# EAGLE schematic S1400XX_EMS_10HP_DS (EAGLE 6.5.0)

## Sheet 1 of 11: Overview
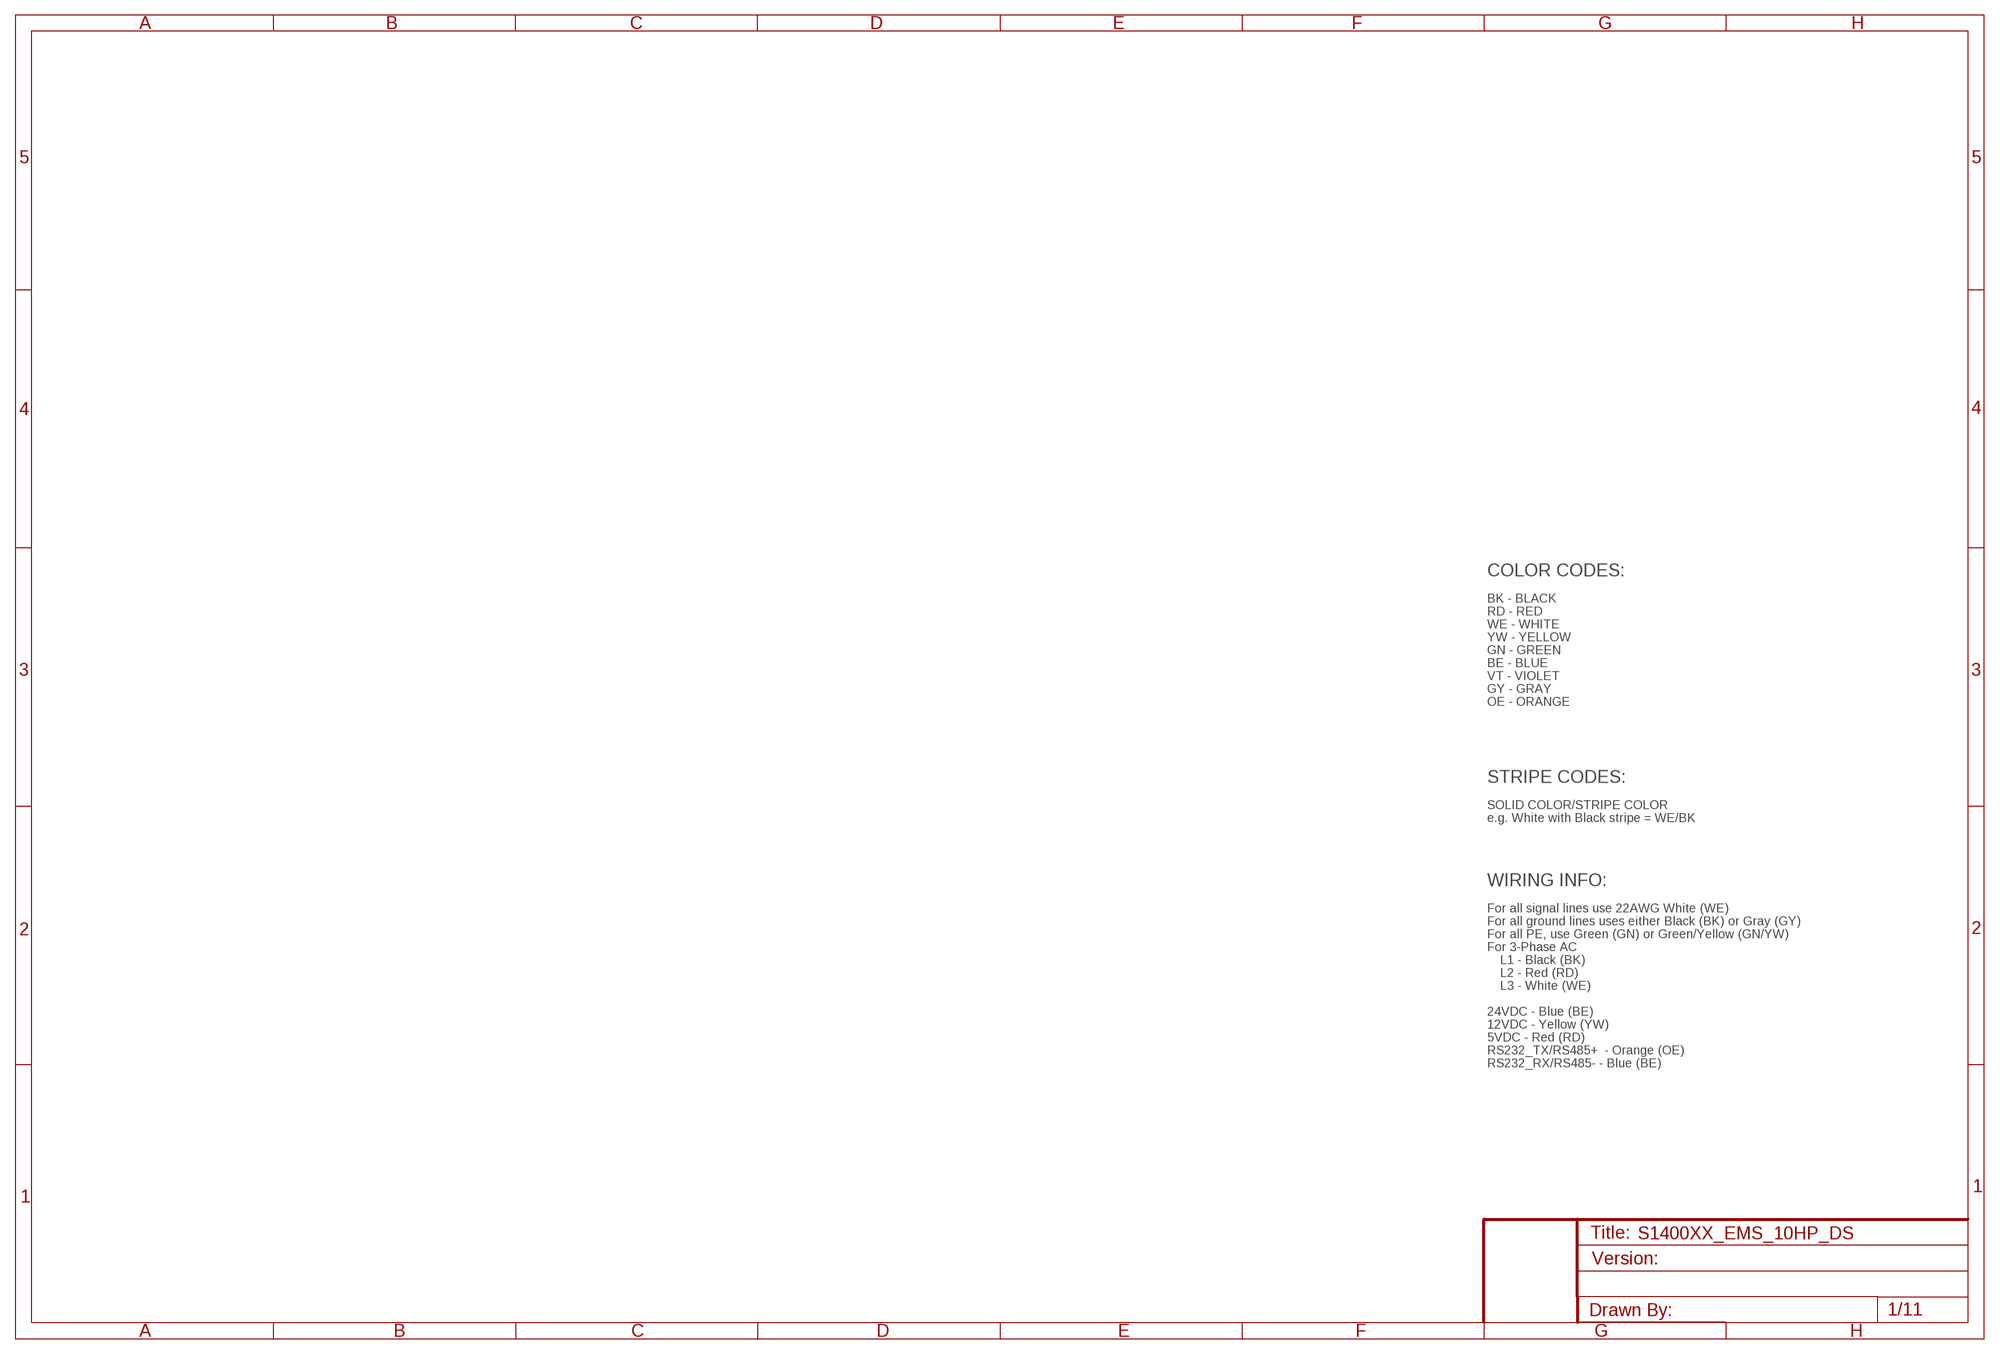
[diagram p0: schematic, sheet 1]

### Notes on the sheet
- COLOR CODES:
- BK - BLACK
- RD - RED
- WE - WHITE
- YW - YELLOW
- GN - GREEN
- BE - BLUE
- VT - VIOLET
- GY - GRAY
- OE - ORANGE
- STRIPE CODES:
- SOLID COLOR/STRIPE COLOR
- e.g. White with Black stripe = WE/BK
- WIRING INFO:
- For all signal lines use 22AWG White (WE)
- For all ground lines uses either Black (BK) or Gray (GY)
- For all PE, use Green (GN) or Green/Yellow (GN/YW)
- For 3-Phase AC
- L1 - Black (BK)
- L2 - Red (RD)
- L3 - White (WE)
- 24VDC - Blue (BE)
- 12VDC - Yellow (YW)
- 5VDC - Red (RD)
- RS232_TX/RS485+  - Orange (OE)
- RS232_RX/RS485- - Blue (BE)

## Sheet 2 of 11: Backplane Layout
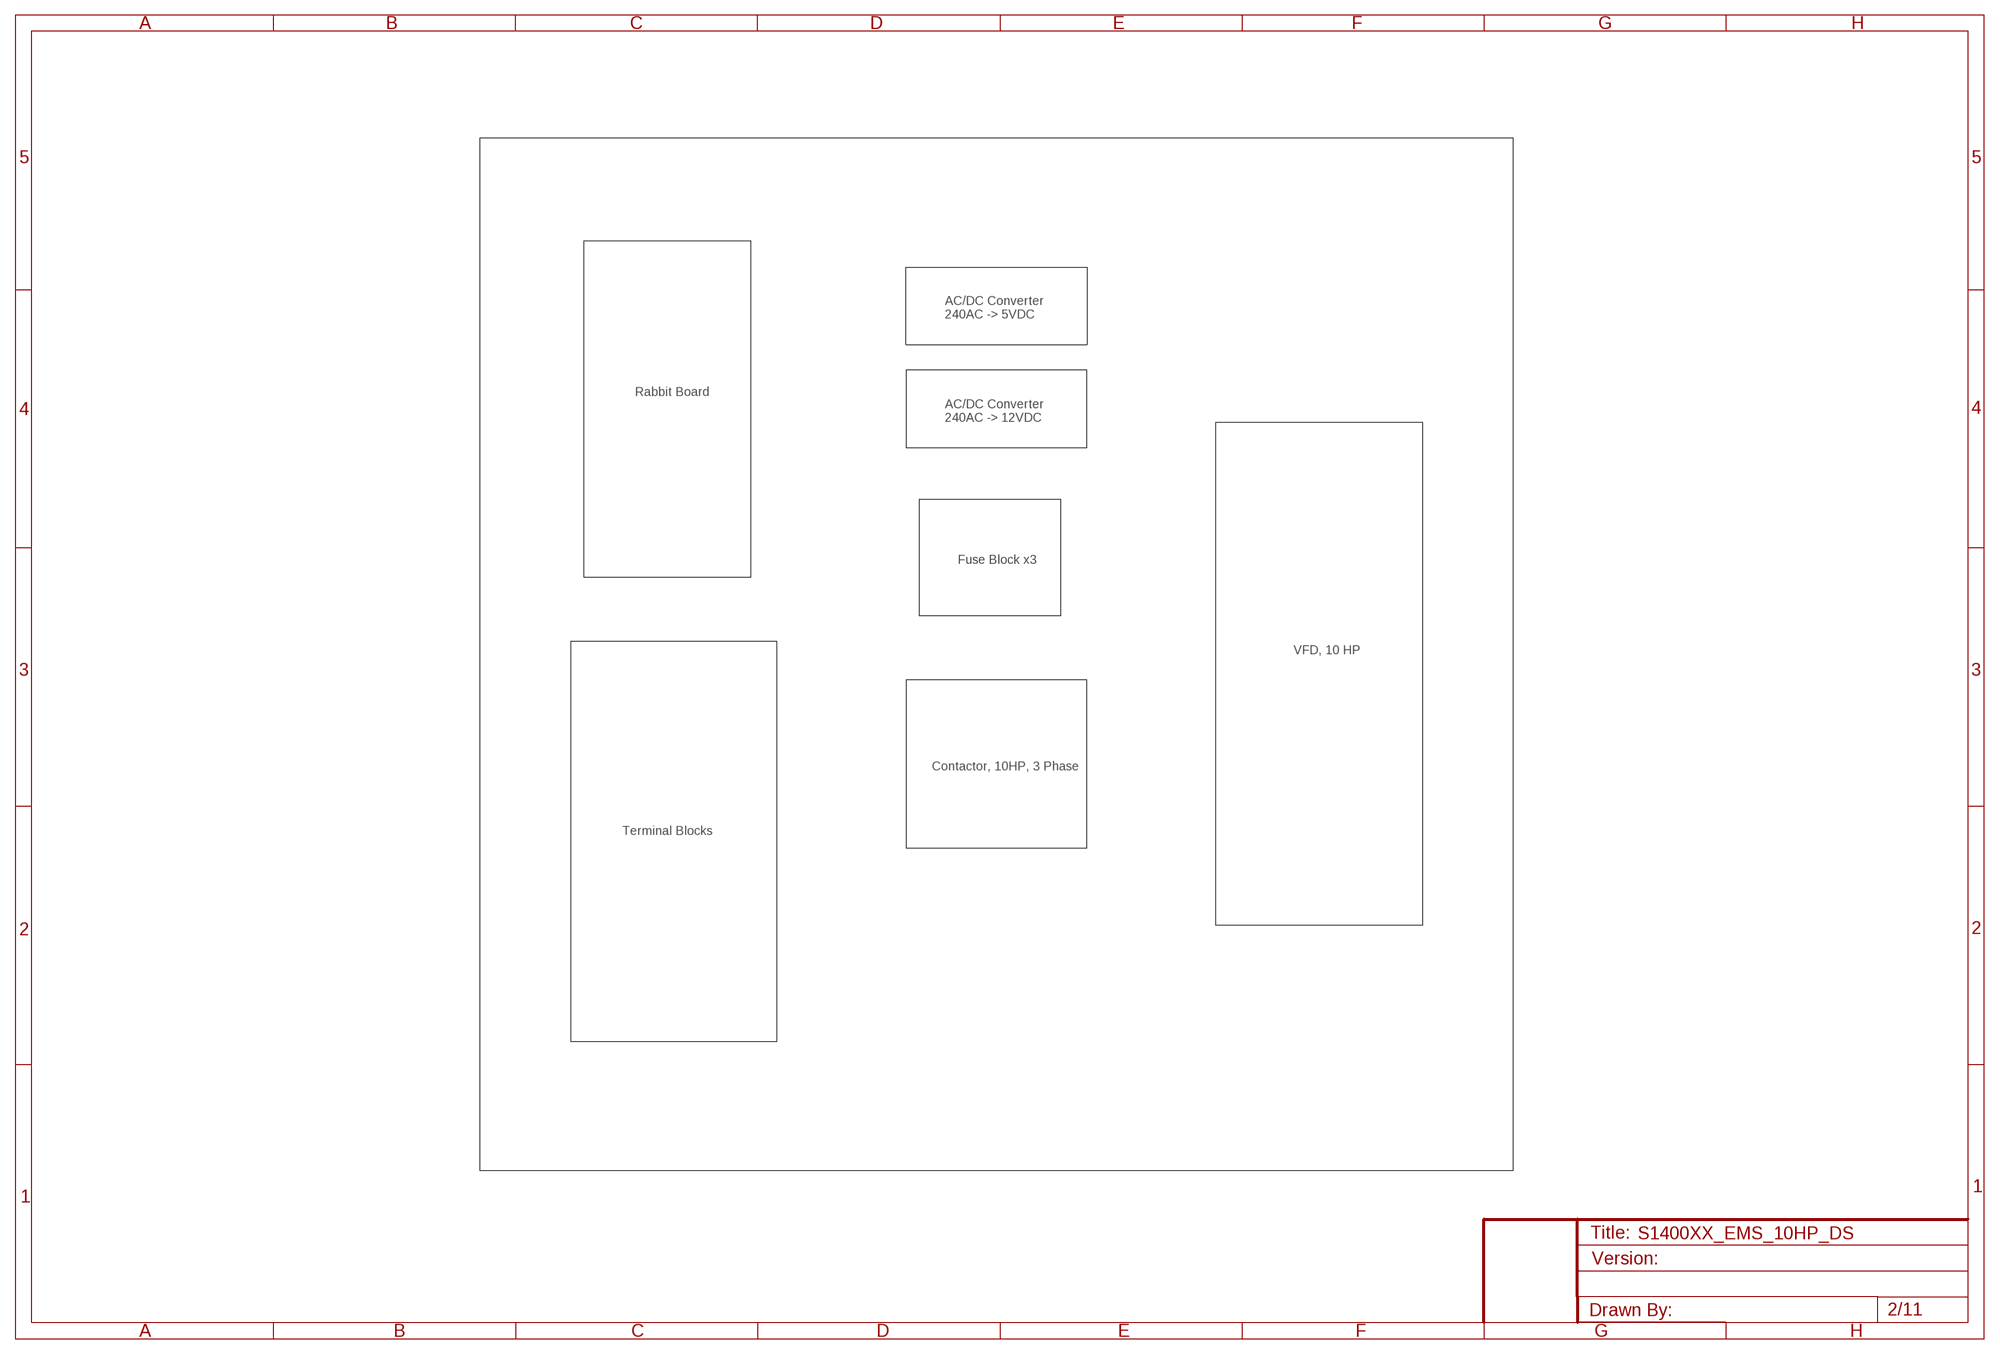
[diagram p1: schematic, sheet 2]

### Notes on the sheet
- AC/DC Converter
  240AC -> 5VDC
- Rabbit Board
- AC/DC Converter
  240AC -> 12VDC
- Fuse Block x3
- VFD, 10 HP
- Contactor, 10HP, 3 Phase
- Terminal Blocks

## Sheet 3 of 11: Terminal Blocks
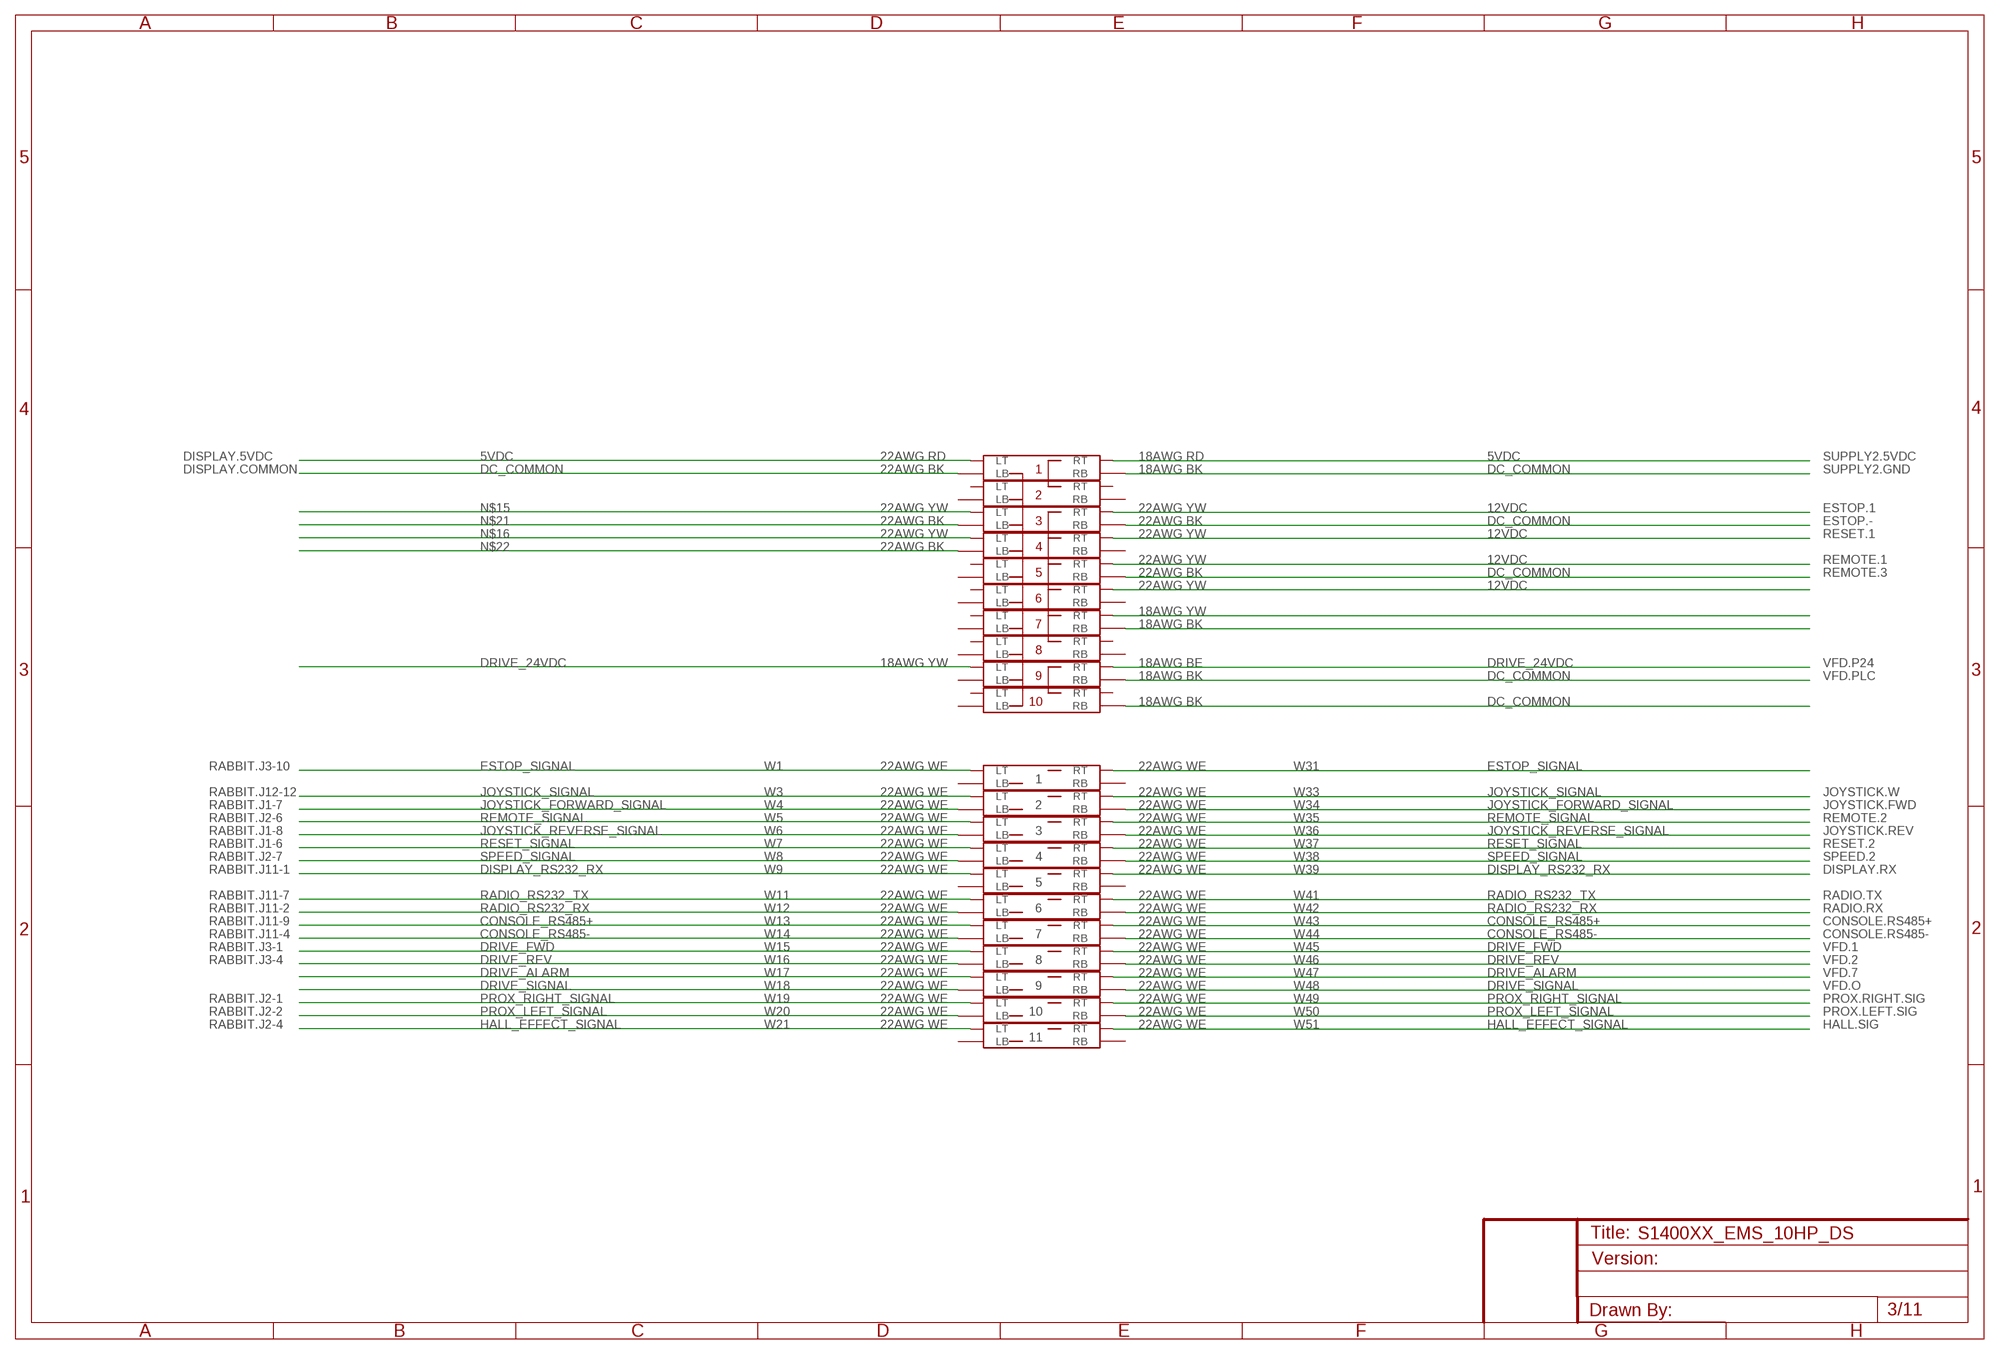
[diagram p2: schematic, sheet 3]

### Parts
U$4  TB_3031160_1POS  [BOGUS]
U$16  TB_3031160_1POS  [BOGUS]
U$17  TB_3031160_1POS  [BOGUS]
U$18  TB_3031160_1POS  [BOGUS]
U$19  TB_3031160_1POS  [BOGUS]
U$20  TB_3031160_1POS  [BOGUS]
U$21  TB_3031160_1POS  [BOGUS]
U$22  TB_3031160_1POS  [BOGUS]
U$23  TB_3031160_1POS  [BOGUS]
U$24  TB_3031160_1POS  [BOGUS]
U$25  TB_3031160_1POS  [BOGUS]
U$26  TB_3031160_1POS  [BOGUS]
U$27  TB_3031160_1POS  [BOGUS]
U$28  TB_3031160_1POS  [BOGUS]
U$29  TB_3031160_1POS  [BOGUS]
U$30  TB_3031160_1POS  [BOGUS]
U$31  TB_3031160_1POS  [BOGUS]
U$32  TB_3031160_1POS  [BOGUS]
U$33  TB_3031160_1POS  [BOGUS]
U$34  TB_3031160_1POS  [BOGUS]
U$35  TB_3031160_1POS  [BOGUS]

### Nets
5VDC: U$35.P$2(LT) U$35.P$4(RT) ; also sheet 4,7
12VDC: U$30.P$4(RT) U$31.P$4(RT) U$32.P$4(RT) U$33.P$4(RT) ; also sheet 4,5,7,9
DC_COMMON: U$26.P$3(RB) U$27.P$3(RB) U$31.P$3(RB) U$33.P$3(RB) U$35.P$1(LB) U$35.P$3(RB) ; also sheet 4,5,6,7,8,9
DISPLAY_RS232_RX: U$19.P$2(LT) ; also sheet 7,10
DRIVE_24VDC: U$27.P$2(LT) U$27.P$4(RT) ; also sheet 5,6
ESTOP_SIGNAL: U$4.P$2(LT) U$4.P$4(RT) ; also sheet 5
JOYSTICK_FORWARD_SIGNAL: U$16.P$1(LB) ; also sheet 5,7,10
JOYSTICK_REVERSE_SIGNAL: U$17.P$1(LB) ; also sheet 5,7,10
JOYSTICK_SIGNAL: U$16.P$2(LT) ; also sheet 5,7,10
N$5: U$29.P$4(RT)
N$7: U$29.P$3(RB)
N$15: U$33.P$2(LT)
N$16: U$32.P$2(LT)
N$21: U$33.P$1(LB)
N$22: U$32.P$1(LB)
REMOTE_SIGNAL: U$17.P$2(LT) ; also sheet 5,7,10
RESET_SIGNAL: U$18.P$2(LT) ; also sheet 5,7,10
SPEED_SIGNAL: U$18.P$1(LB) ; also sheet 5,7
Unconnected: U$4.P$1(LB) U$4.P$3(RB) U$16.P$3(RB) U$16.P$4(RT) U$17.P$3(RB) U$17.P$4(RT) U$18.P$3(RB) U$18.P$4(RT) U$19.P$1(LB) U$19.P$3(RB) U$19.P$4(RT) U$20.P$1(LB) U$20.P$2(LT) U$20.P$3(RB) U$20.P$4(RT) U$21.P$1(LB) U$21.P$2(LT) U$21.P$3(RB) U$21.P$4(RT) U$22.P$1(LB) U$22.P$2(LT) U$22.P$3(RB) U$22.P$4(RT) U$23.P$1(LB) U$23.P$2(LT) U$23.P$3(RB) U$23.P$4(RT) U$24.P$1(LB) U$24.P$2(LT) U$24.P$3(RB) U$24.P$4(RT) U$25.P$1(LB) U$25.P$2(LT) U$25.P$3(RB) U$25.P$4(RT) U$26.P$1(LB) U$26.P$2(LT) U$26.P$4(RT) U$27.P$1(LB) U$28.P$1(LB) U$28.P$2(LT) U$28.P$3(RB) U$28.P$4(RT) U$29.P$1(LB) U$29.P$2(LT) U$30.P$1(LB) U$30.P$2(LT) U$30.P$3(RB) U$31.P$1(LB) U$31.P$2(LT) U$32.P$3(RB) U$34.P$1(LB) U$34.P$2(LT) U$34.P$3(RB) U$34.P$4(RT)

### Notes on the sheet
- DISPLAY.5VDC | 22AWG RD | 18AWG RD | SUPPLY2.5VDC
- DISPLAY.COMMON | 22AWG BK | 1 | 18AWG BK | SUPPLY2.GND
- 2
- 22AWG YW | 22AWG YW | ESTOP.1
- 22AWG BK | 3 | 22AWG BK | ESTOP.-
- 22AWG YW | 22AWG YW | RESET.1
- 22AWG BK | 4
- 22AWG YW | REMOTE.1
- 5 | 22AWG BK | REMOTE.3
- 22AWG YW
- 6
- 18AWG YW
- 7 | 18AWG BK
- 8
- 18AWG YW | 18AWG BE | VFD.P24
- 9 | 18AWG BK | VFD.PLC
- 10 | 18AWG BK
- RABBIT.J3-10 | W1 | 22AWG WE | 22AWG WE | W31
- 1
- RABBIT.J12-12 | W3 | 22AWG WE | 22AWG WE | W33 | JOYSTICK.W
- RABBIT.J1-7 | W4 | 22AWG WE | 2 | 22AWG WE | W34 | JOYSTICK.FWD
- RABBIT.J2-6 | W5 | 22AWG WE | 22AWG WE | W35 | REMOTE.2
- RABBIT.J1-8 | W6 | 22AWG WE | 3 | 22AWG WE | W36 | JOYSTICK.REV
- RABBIT.J1-6 | W7 | 22AWG WE | 22AWG WE | W37 | RESET.2
- RABBIT.J2-7 | W8 | 22AWG WE | 4 | 22AWG WE | W38 | SPEED.2
- RABBIT.J11-1 | W9 | 22AWG WE | 22AWG WE | W39 | DISPLAY.RX
- 5
- RABBIT.J11-7 | W11 | 22AWG WE | 22AWG WE | W41 | RADIO.TX
- RABBIT.J11-2 | W12 | 22AWG WE | 6 | 22AWG WE | W42 | RADIO.RX
- RABBIT.J11-9 | W13 | 22AWG WE | 22AWG WE | W43 | CONSOLE.RS485+
- RABBIT.J11-4 | W14 | 22AWG WE | 7 | 22AWG WE | W44 | CONSOLE.RS485-
- RABBIT.J3-1 | W15 | 22AWG WE | 22AWG WE | W45 | VFD.1
- RABBIT.J3-4 | W16 | 22AWG WE | 8 | 22AWG WE | W46 | VFD.2
- W17 | 22AWG WE | 22AWG WE | W47 | VFD.7
- W18 | 22AWG WE | 9 | 22AWG WE | W48 | VFD.O
- RABBIT.J2-1 | W19 | 22AWG WE | 22AWG WE | W49 | PROX.RIGHT.SIG
- RABBIT.J2-2 | W20 | 22AWG WE | 10 | 22AWG WE | W50 | PROX.LEFT.SIG
- RABBIT.J2-4 | W21 | 22AWG WE | 22AWG WE | W51 | HALL.SIG
- 11

## Sheet 4 of 11: DC/DC Converter
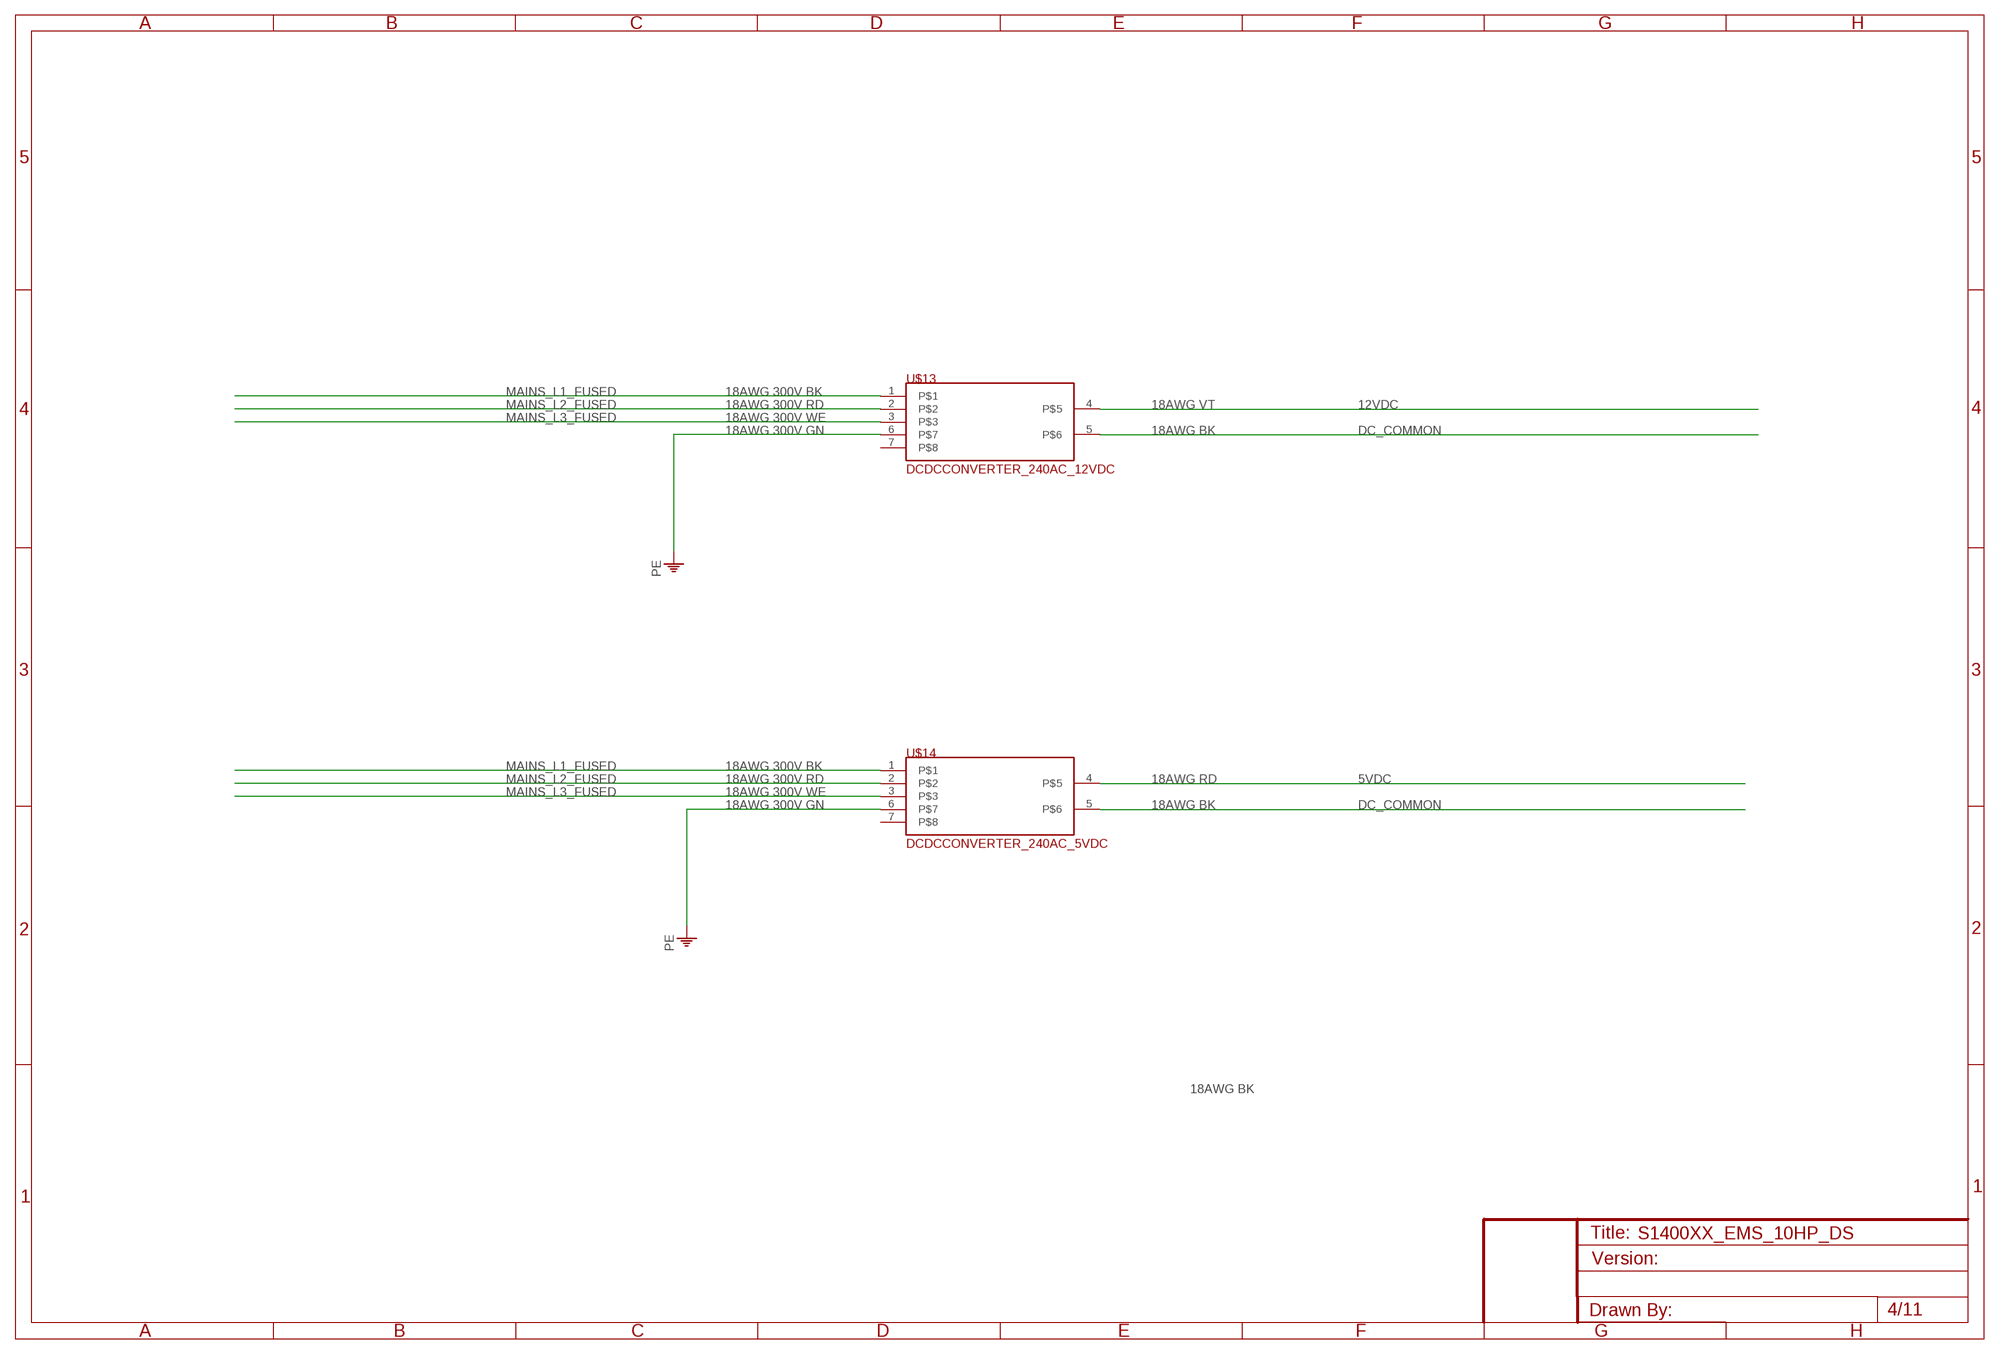
[diagram p3: schematic, sheet 4]

### Parts
U$13  DCDCCONVERTER_240AC_12VDC  [SSOP16]
U$14  DCDCCONVERTER_240AC_5VDC  [SSOP16]

### Nets
5VDC: U$14.4 ; also sheet 3,7
12VDC: U$13.4 ; also sheet 3,5,7,9
DC_COMMON: U$13.5 U$14.5 ; also sheet 3,5,6,7,8,9
MAINS_L1_FUSED: U$13.1 U$14.1 ; also sheet 6,8,9
MAINS_L2_FUSED: U$13.2 U$14.2 ; also sheet 6,8,9
MAINS_L3_FUSED: U$13.3 U$14.3 ; also sheet 6,8,9
PE: U$13.6 U$14.6 ; also sheet 6,9
Unconnected: U$13.7 U$14.7

### Notes on the sheet
- 18AWG 300V BK
- 18AWG 300V RD | 18AWG VT
- 18AWG 300V WE
- 18AWG 300V GN | 18AWG BK
- 18AWG 300V BK
- 18AWG 300V RD | 18AWG RD
- 18AWG 300V WE
- 18AWG 300V GN | 18AWG BK
- 18AWG BK

## Sheet 5 of 11: Rabbit Board Wiring
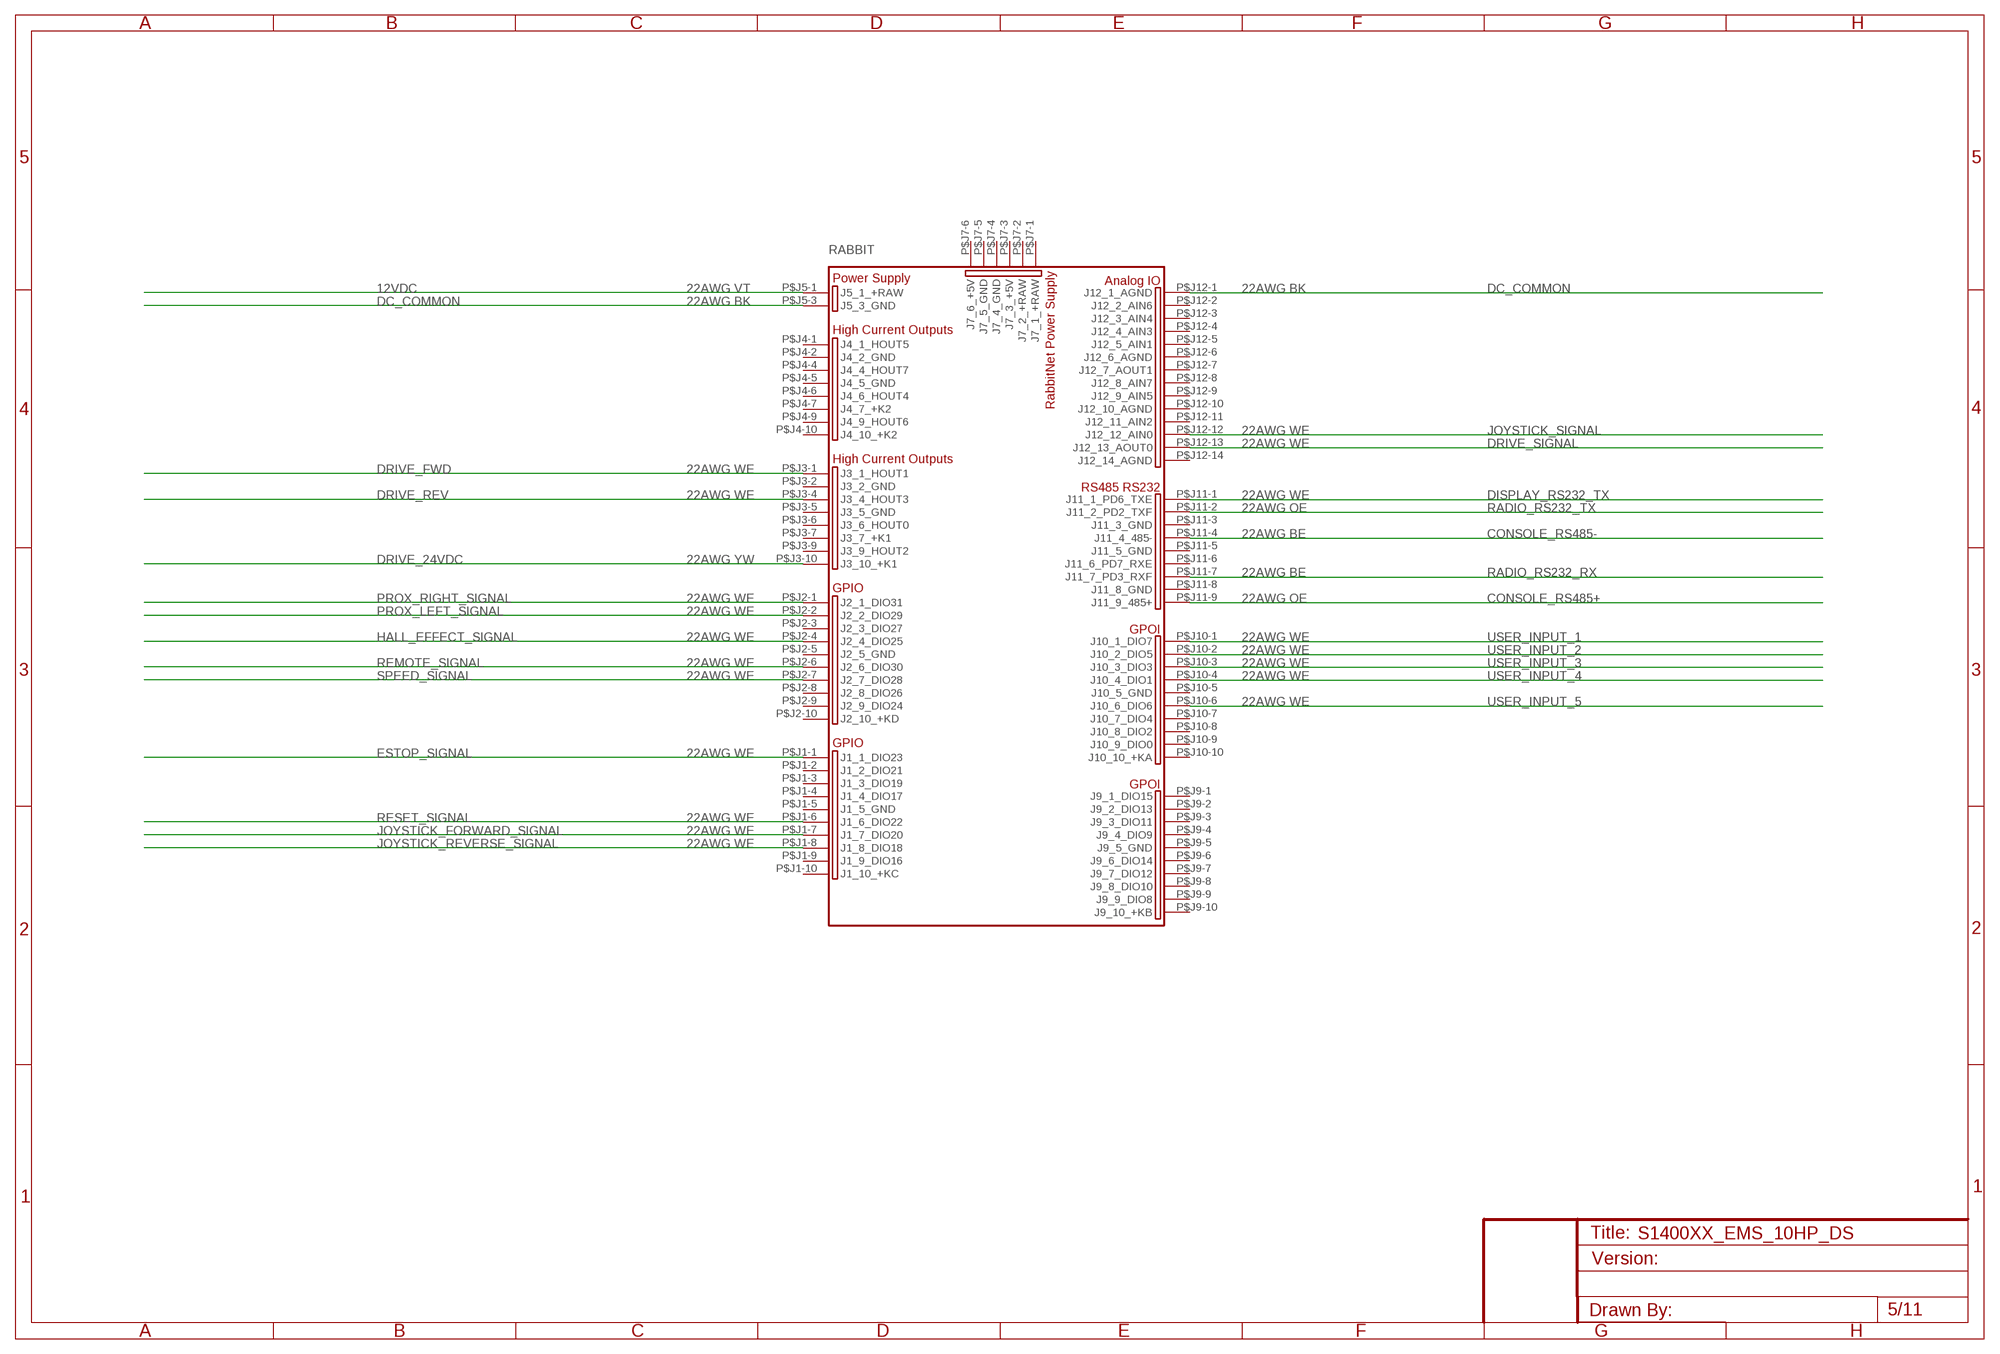
[diagram p4: schematic, sheet 5]

### Parts
U$1  RABBIT_BL4S200(RCM4310)  [RABBIT_BL4S200]

### Nets
12VDC: U$1.P$J5-1(J5_1_+RAW) ; also sheet 3,4,7,9
CONSOLE_RS485+: U$1.P$J11-9(J11_9_485+) ; also sheet 3,10
CONSOLE_RS485-: U$1.P$J11-4(J11_4_485-) ; also sheet 3,10
DC_COMMON: U$1.P$J5-3(J5_3_GND) U$1.P$J12-1(J12_1_AGND) ; also sheet 3,4,6,7,8,9
DISPLAY_RS232_TX: U$1.P$J11-1(J11_1_PD6_TXE) ; also sheet 10
DRIVE_24VDC: U$1.P$J3-10(J3_10_+K1) ; also sheet 3,6
DRIVE_FWD: U$1.P$J3-1(J3_1_HOUT1) ; also sheet 3,6
DRIVE_REV: U$1.P$J3-4(J3_4_HOUT3) ; also sheet 3,6
DRIVE_SIGNAL: U$1.P$J12-13(J12_13_AOUT0) ; also sheet 3,6,9,10
ESTOP_SIGNAL: U$1.P$J1-1(J1_1_DIO23) ; also sheet 3
HALL_EFFECT_SIGNAL: U$1.P$J2-4(J2_4_DIO25) ; also sheet 3,10
JOYSTICK_FORWARD_SIGNAL: U$1.P$J1-7(J1_7_DIO20) ; also sheet 3,7,10
JOYSTICK_REVERSE_SIGNAL: U$1.P$J1-8(J1_8_DIO18) ; also sheet 3,7,10
JOYSTICK_SIGNAL: U$1.P$J12-12(J12_12_AIN0) ; also sheet 3,7,10
PROX_LEFT_SIGNAL: U$1.P$J2-2(J2_2_DIO29) ; also sheet 3,10
PROX_RIGHT_SIGNAL: U$1.P$J2-1(J2_1_DIO31) ; also sheet 3,10
RADIO_RS232_RX: U$1.P$J11-7(J11_7_PD3_RXF) ; also sheet 3,7,10
RADIO_RS232_TX: U$1.P$J11-2(J11_2_PD2_TXF) ; also sheet 3,7,10
REMOTE_SIGNAL: U$1.P$J2-6(J2_6_DIO30) ; also sheet 3,7,10
RESET_SIGNAL: U$1.P$J1-6(J1_6_DIO22) ; also sheet 3,7,10
SPEED_SIGNAL: U$1.P$J2-7(J2_7_DIO28) ; also sheet 3,7
USER_INPUT_1: U$1.P$J10-1(J10_1_DIO7)
USER_INPUT_2: U$1.P$J10-2(J10_2_DIO5)
USER_INPUT_3: U$1.P$J10-3(J10_3_DIO3)
USER_INPUT_4: U$1.P$J10-4(J10_4_DIO1)
USER_INPUT_5: U$1.P$J10-6(J10_6_DIO6)
Unconnected: U$1.P$J1-2(J1_2_DIO21) U$1.P$J1-3(J1_3_DIO19) U$1.P$J1-4(J1_4_DIO17) U$1.P$J1-5(J1_5_GND) U$1.P$J1-9(J1_9_DIO16) U$1.P$J1-10(J1_10_+KC) U$1.P$J2-3(J2_3_DIO27) U$1.P$J2-5(J2_5_GND) U$1.P$J2-8(J2_8_DIO26) U$1.P$J2-9(J2_9_DIO24) U$1.P$J2-10(J2_10_+KD) U$1.P$J3-2(J3_2_GND) U$1.P$J3-5(J3_5_GND) U$1.P$J3-6(J3_6_HOUT0) U$1.P$J3-7(J3_7_+K1) U$1.P$J3-9(J3_9_HOUT2) U$1.P$J4-1(J4_1_HOUT5) U$1.P$J4-2(J4_2_GND) U$1.P$J4-4(J4_4_HOUT7) U$1.P$J4-5(J4_5_GND) U$1.P$J4-6(J4_6_HOUT4) U$1.P$J4-7(J4_7_+K2) U$1.P$J4-9(J4_9_HOUT6) U$1.P$J4-10(J4_10_+K2) U$1.P$J7-1(J7_1_+RAW) U$1.P$J7-2(J7_2_+RAW) U$1.P$J7-3(J7_3_+5V) U$1.P$J7-4(J7_4_GND) U$1.P$J7-5(J7_5_GND) U$1.P$J7-6(J7_6_+5V) U$1.P$J9-1(J9_1_DIO15) U$1.P$J9-2(J9_2_DIO13) U$1.P$J9-3(J9_3_DIO11) U$1.P$J9-4(J9_4_DIO9) U$1.P$J9-5(J9_5_GND) U$1.P$J9-6(J9_6_DIO14) U$1.P$J9-7(J9_7_DIO12) U$1.P$J9-8(J9_8_DIO10) U$1.P$J9-9(J9_9_DIO8) U$1.P$J9-10(J9_10_+KB) U$1.P$J10-5(J10_5_GND) U$1.P$J10-7(J10_7_DIO4) U$1.P$J10-8(J10_8_DIO2) U$1.P$J10-9(J10_9_DIO0) U$1.P$J10-10(J10_10_+KA) U$1.P$J11-3(J11_3_GND) U$1.P$J11-5(J11_5_GND) U$1.P$J11-6(J11_6_PD7_RXE) U$1.P$J11-8(J11_8_GND) U$1.P$J12-2(J12_2_AIN6) U$1.P$J12-3(J12_3_AIN4) U$1.P$J12-4(J12_4_AIN3) U$1.P$J12-5(J12_5_AIN1) U$1.P$J12-6(J12_6_AGND) U$1.P$J12-7(J12_7_AOUT1) U$1.P$J12-8(J12_8_AIN7) U$1.P$J12-9(J12_9_AIN5) U$1.P$J12-10(J12_10_AGND) U$1.P$J12-11(J12_11_AIN2) U$1.P$J12-14(J12_14_AGND)

### Notes on the sheet
- RABBIT
- 22AWG VT | 22AWG BK
- 22AWG BK
- 22AWG WE
- 22AWG WE
- 22AWG WE
- 22AWG WE | 22AWG WE
- 22AWG OE
- 22AWG BE
- 22AWG YW
- 22AWG BE
- 22AWG WE | 22AWG OE
- 22AWG WE
- 22AWG WE | 22AWG WE
- 22AWG WE
- 22AWG WE | 22AWG WE
- 22AWG WE | 22AWG WE
- 22AWG WE
- 22AWG WE
- 22AWG WE
- 22AWG WE
- 22AWG WE

## Sheet 6 of 11: VFD - Hitachi
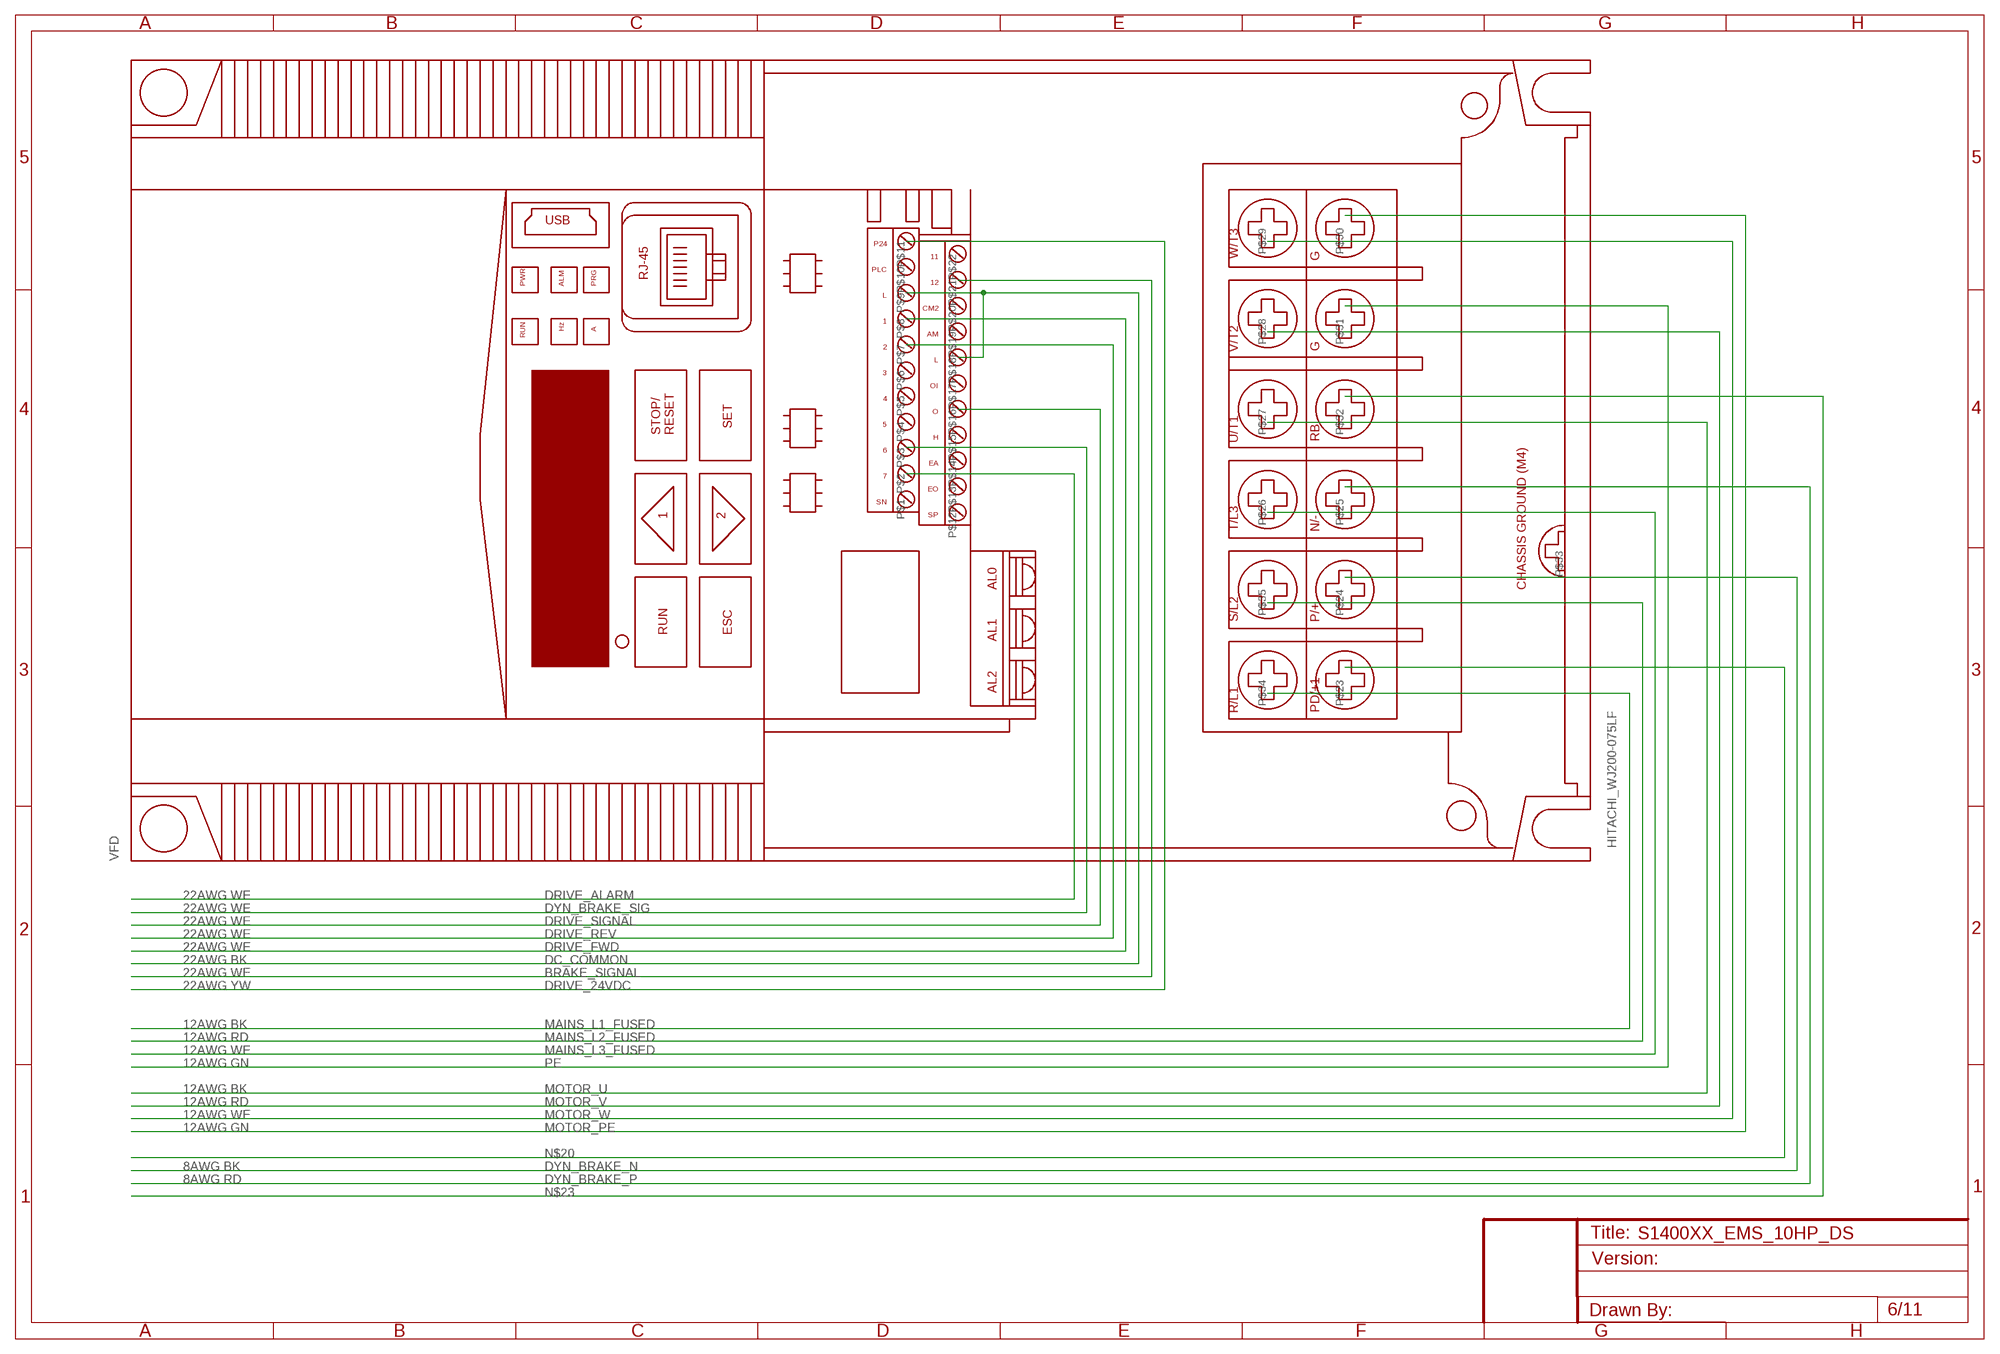
[diagram p5: schematic, sheet 6]

### Parts
VFD  HITACHI_WJ200-075LF  [BOGUS]

### Nets
BRAKE_SIGNAL: VFD.P$21
DC_COMMON: VFD.P$9 VFD.P$18 ; also sheet 3,4,5,7,8,9
DRIVE_24VDC: VFD.P$11 ; also sheet 3,5
DRIVE_ALARM: VFD.P$2 ; also sheet 3
DRIVE_FWD: VFD.P$8 ; also sheet 3,5
DRIVE_REV: VFD.P$7 ; also sheet 3,5
DRIVE_SIGNAL: VFD.P$16 ; also sheet 3,5,9,10
DYN_BRAKE_SIG: VFD.P$3
Unconnected: VFD.P$1 VFD.P$4 VFD.P$5 VFD.P$6 VFD.P$10 VFD.P$12 VFD.P$13 VFD.P$14 VFD.P$15 VFD.P$17 VFD.P$19 VFD.P$20 VFD.P$22 VFD.P$23 VFD.P$24 VFD.P$25 VFD.P$26 VFD.P$27 VFD.P$28 VFD.P$29 VFD.P$30 VFD.P$31 VFD.P$32 VFD.P$33 VFD.P$34 VFD.P$35

### Notes on the sheet
- 22AWG WE
- 22AWG WE
- 22AWG WE
- 22AWG WE
- 22AWG WE
- 22AWG BK
- 22AWG WE
- 22AWG YW
- 12AWG BK
- 12AWG RD
- 12AWG WE
- 12AWG GN
- 12AWG BK
- 12AWG RD
- 12AWG WE
- 12AWG GN
- 8AWG BK
- 8AWG RD

## Sheet 7 of 11
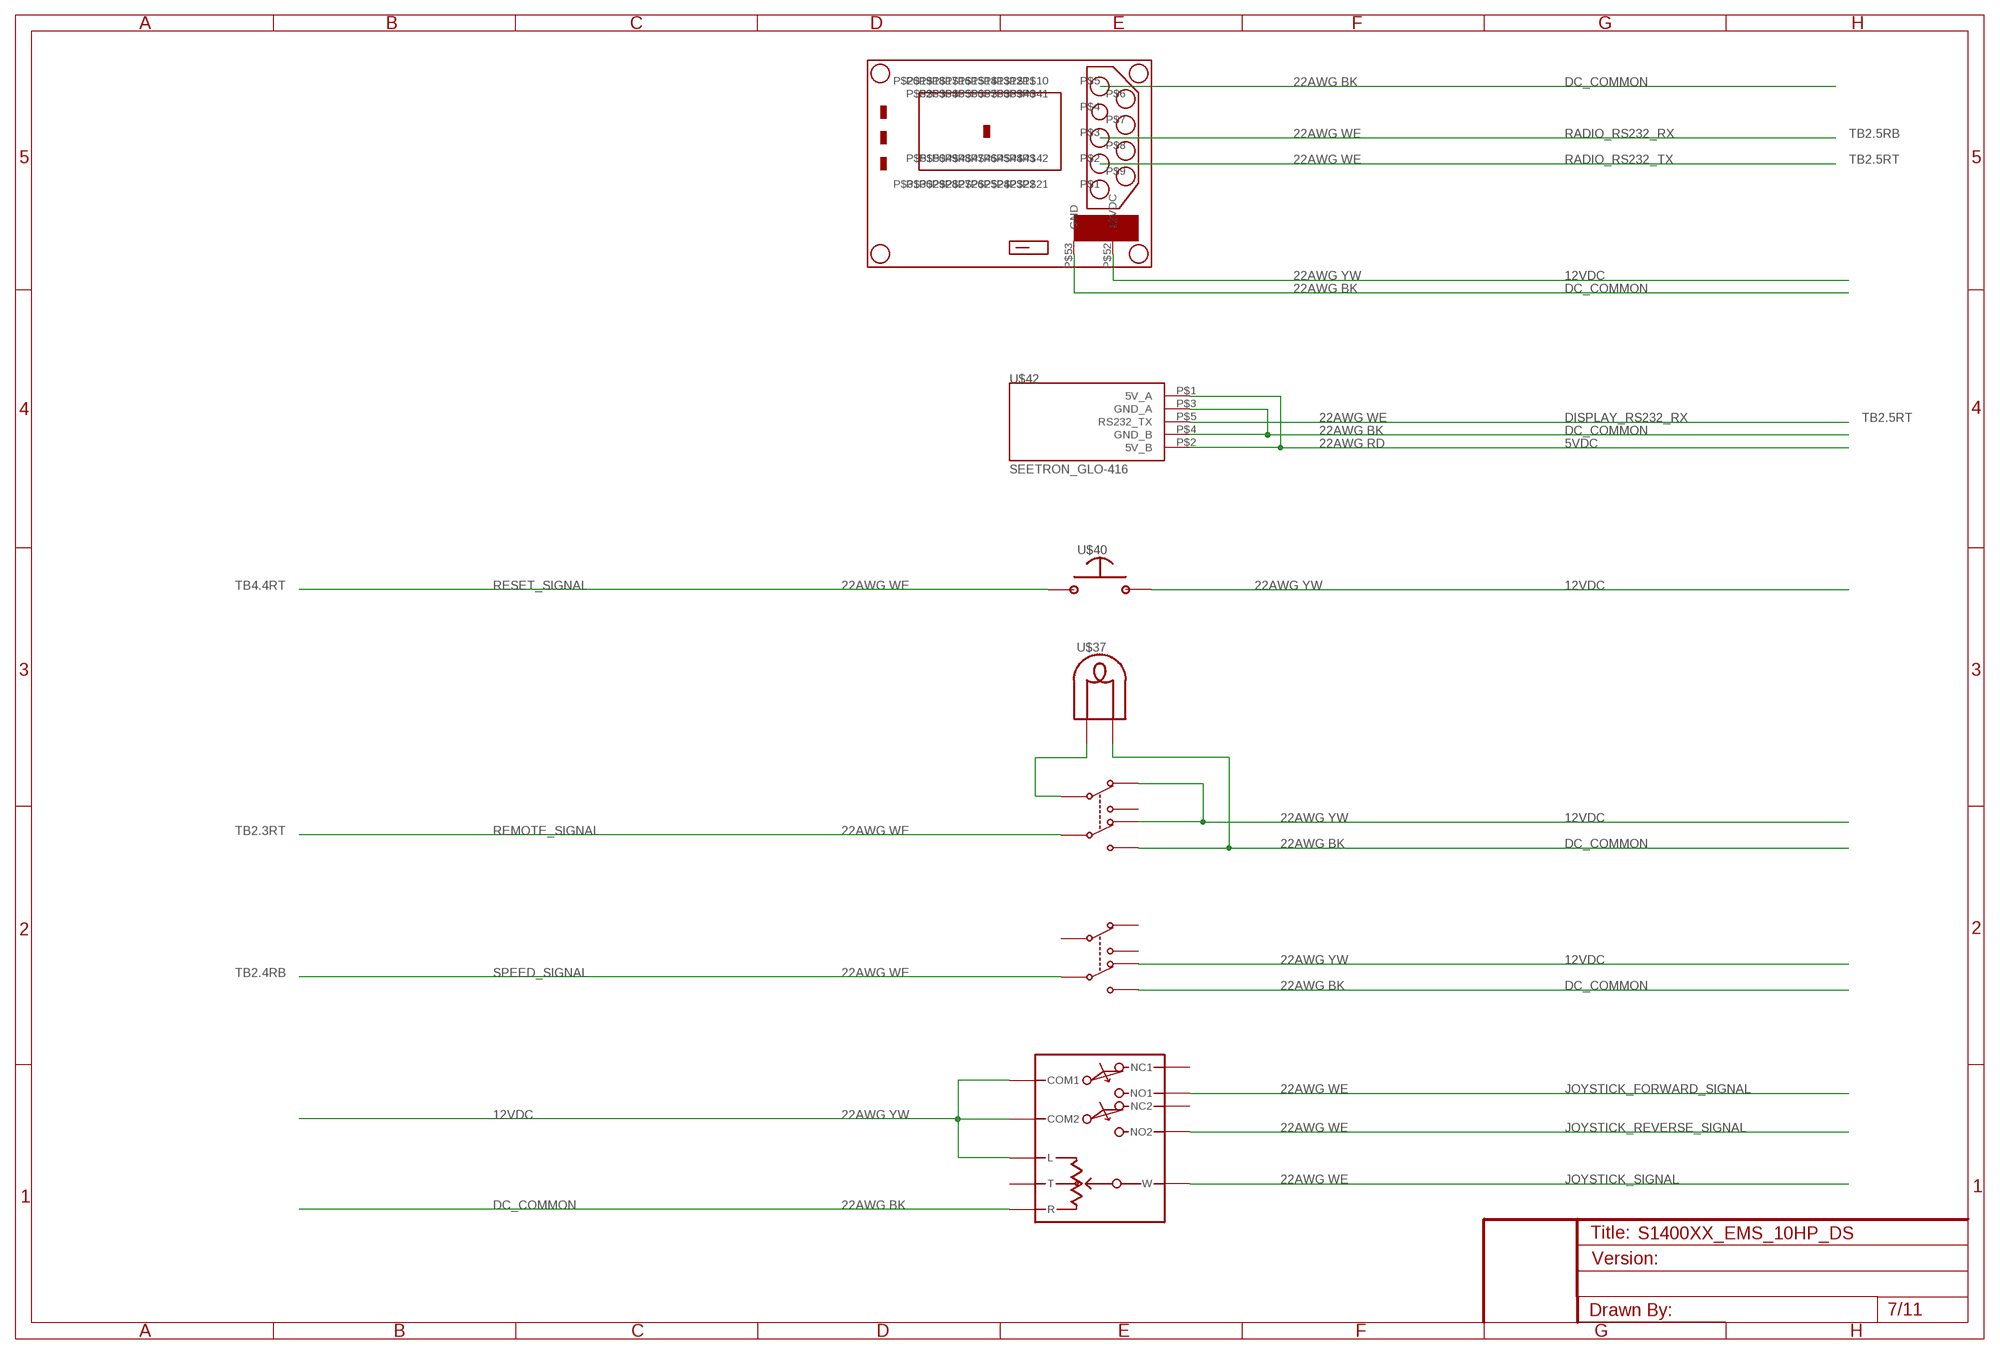
[diagram p6: schematic, sheet 7]

### Parts
U$36  JOYSTICK_PRO-5  [BOGUS]
U$37  INDICATOR_LIGHT  [BOGUS]
U$38  SWITCH_DPDT  [BOGUS]
U$39  SWITCH_DPDT  [BOGUS]
U$40  SWITCH_MOM_NO  [BOGUS]
U$41  SPARKFUN_XBEE_EXPLORER_SERIAL  [BOGUS]
U$42  SEETRON_GLO-416  [BOGUS]

### Nets
5VDC: U$42.P$1(5V_A) U$42.P$2(5V_B) ; also sheet 3,4
12VDC: U$36.P$1(COM1) U$36.P$2(COM2) U$36.P$3(L) U$38.P$5 U$39.P$2 U$39.P$5 U$40.P$2 U$41.P$52(12VDC) ; also sheet 3,4,5,9
DC_COMMON: U$36.P$8(R) U$37.P$2 U$38.P$6 U$39.P$6 U$41.P$5 U$41.P$53(GND) U$42.P$3(GND_A) U$42.P$4(GND_B) ; also sheet 3,4,5,6,8,9
DISPLAY_RS232_RX: U$42.P$5(RS232_TX) ; also sheet 3,10
JOYSTICK_FORWARD_SIGNAL: U$36.P$6(NO1) ; also sheet 3,5,10
JOYSTICK_REVERSE_SIGNAL: U$36.P$7(NO2) ; also sheet 3,5,10
JOYSTICK_SIGNAL: U$36.P$10(W) ; also sheet 3,5,10
N$32: U$37.P$1 U$39.P$1
RADIO_RS232_RX: U$41.P$3 ; also sheet 3,5,10
RADIO_RS232_TX: U$41.P$2 ; also sheet 3,5,10
REMOTE_SIGNAL: U$39.P$4 ; also sheet 3,5,10
RESET_SIGNAL: U$40.P$1 ; also sheet 3,5,10
SPEED_SIGNAL: U$38.P$4 ; also sheet 3,5
Unconnected: U$36.P$4(NC1) U$36.P$5(NC2) U$36.P$9(T) U$38.P$1 U$38.P$2 U$38.P$3 U$39.P$3 U$41.P$1 U$41.P$4 U$41.P$6 U$41.P$7 U$41.P$8 U$41.P$9 U$41.P$10 U$41.P$11 U$41.P$12 U$41.P$13 U$41.P$14 U$41.P$15 U$41.P$16 U$41.P$17 U$41.P$18 U$41.P$19 U$41.P$20 U$41.P$21 U$41.P$22 U$41.P$23 U$41.P$24 U$41.P$25 U$41.P$26 U$41.P$27 U$41.P$28 U$41.P$29 U$41.P$30 U$41.P$31 U$41.P$32 U$41.P$33 U$41.P$34 U$41.P$35 U$41.P$36 U$41.P$37 U$41.P$38 U$41.P$39 U$41.P$40 U$41.P$41 U$41.P$42 U$41.P$43 U$41.P$44 U$41.P$45 U$41.P$46 U$41.P$47 U$41.P$48 U$41.P$49 U$41.P$50 U$41.P$51

### Notes on the sheet
- 22AWG BK
- 22AWG WE | TB2.5RB
- 22AWG WE | TB2.5RT
- 22AWG YW
- 22AWG BK
- 22AWG WE | TB2.5RT
- 22AWG BK
- 22AWG RD
- TB4.4RT | 22AWG WE | 22AWG YW
- 22AWG YW
- TB2.3RT | 22AWG WE
- 22AWG BK
- 22AWG YW
- TB2.4RB | 22AWG WE
- 22AWG BK
- 22AWG WE
- 22AWG YW
- 22AWG WE
- 22AWG WE
- 22AWG BK

## Sheet 8 of 11: VFD Wiring
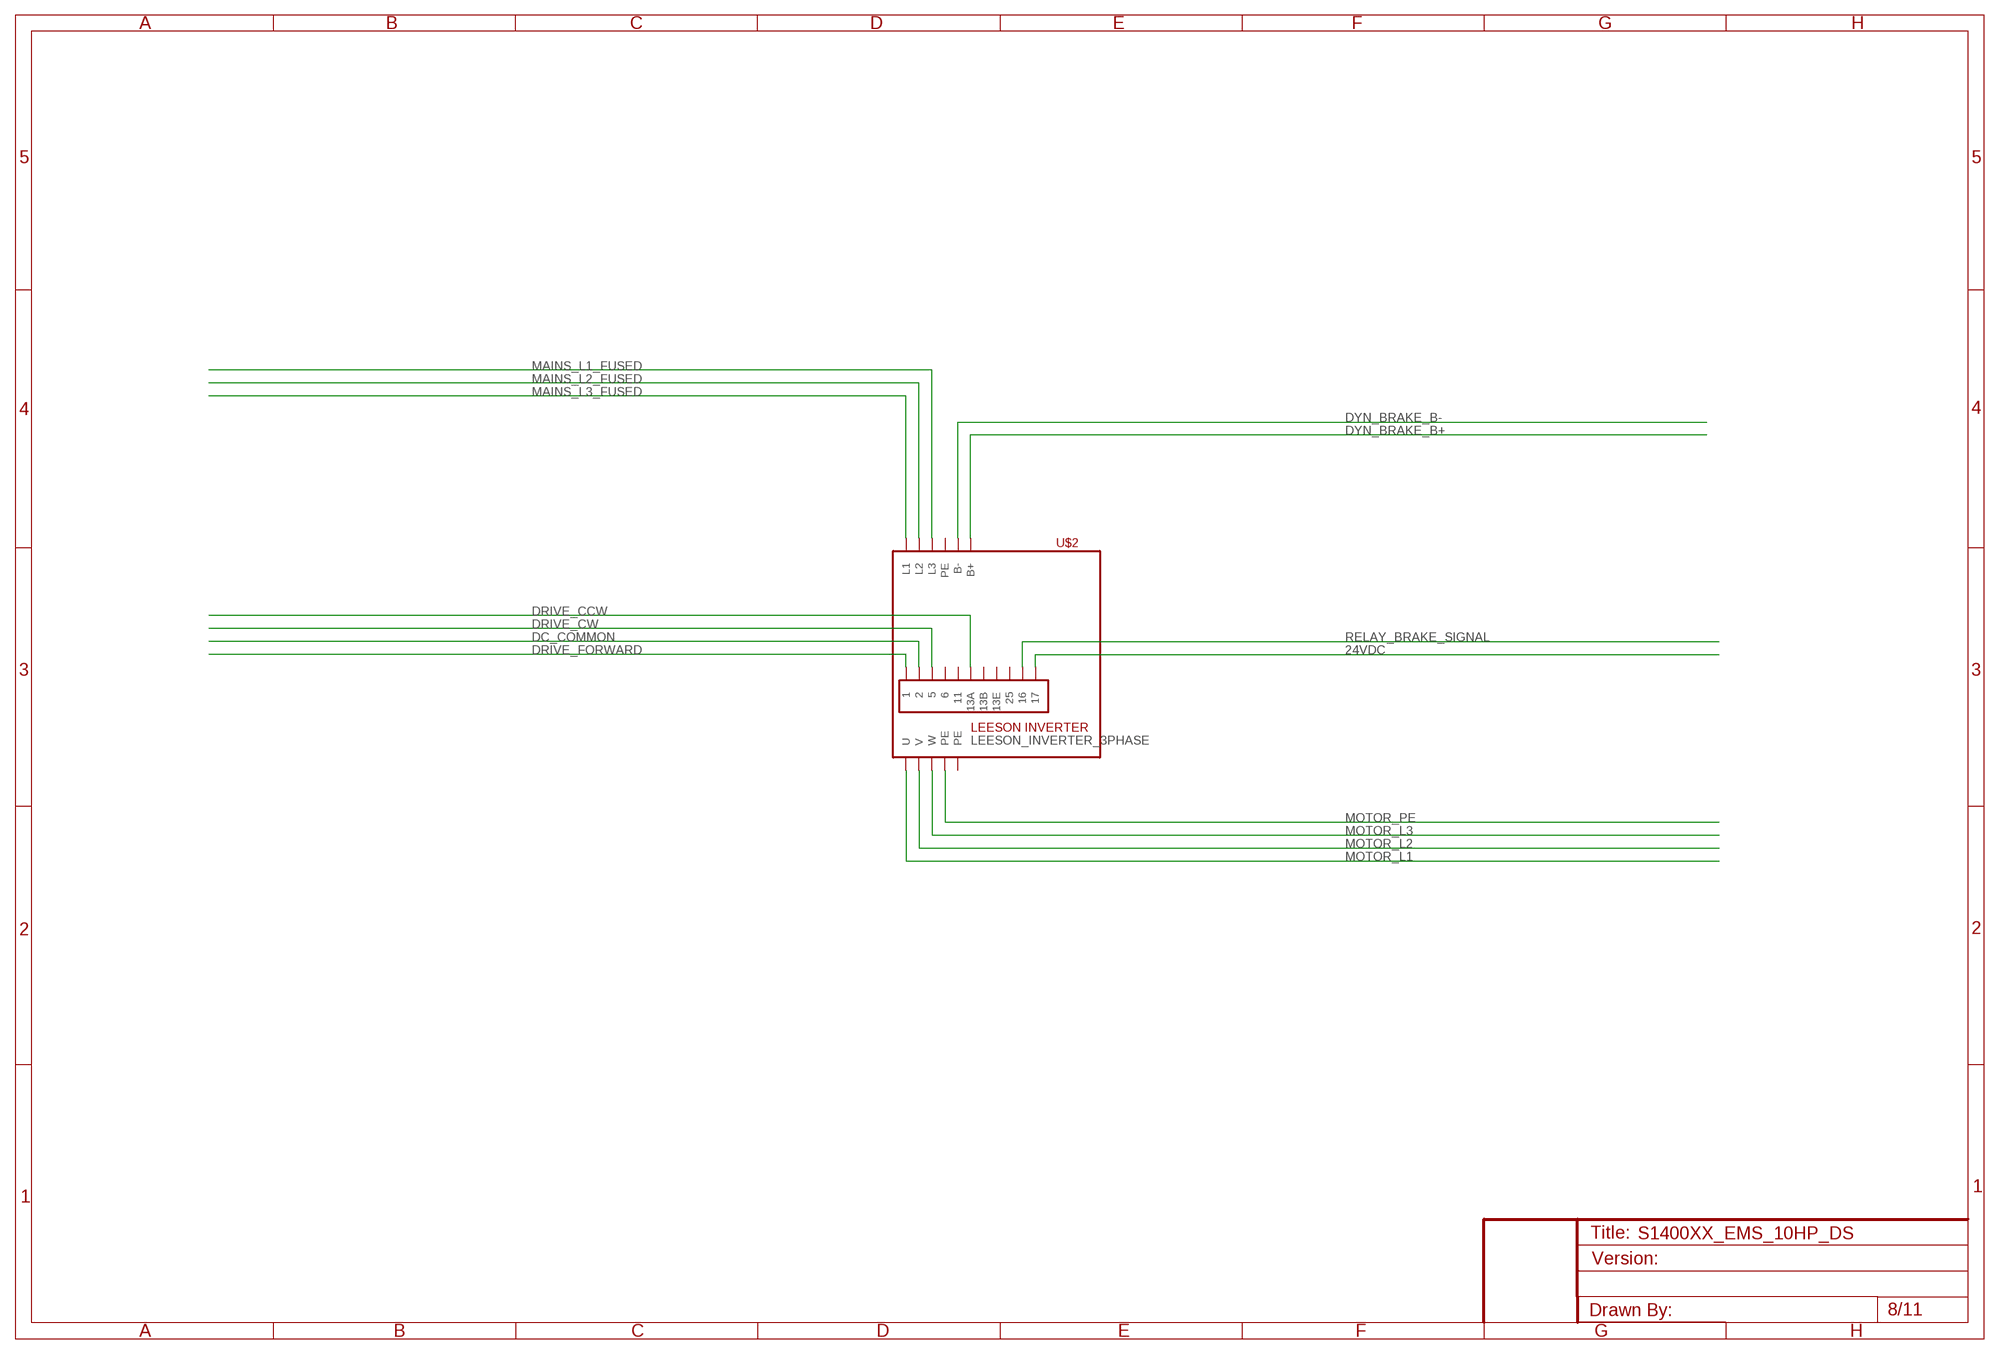
[diagram p7: schematic, sheet 8]

### Parts
U$2  LEESON_INVERTER_3PHASE  [BOGUS]

### Nets
24VDC: U$2.P$10 ; also sheet 9
DC_COMMON: U$2.P$2 ; also sheet 3,4,5,6,7,9
DRIVE_CCW: U$2.P$6(13A) ; also sheet 9,10
DRIVE_CW: U$2.P$3 ; also sheet 9,10
DRIVE_FORWARD: U$2.P$1
DYN_BRAKE_B+: U$2.P$12(B+)
DYN_BRAKE_B-: U$2.P$13(B-)
MAINS_L1_FUSED: U$2.P$16(L3) ; also sheet 4,6,9
MAINS_L2_FUSED: U$2.P$15(L2) ; also sheet 4,6,9
MAINS_L3_FUSED: U$2.P$14(L1) ; also sheet 4,6,9
MOTOR_L1: U$2.P$20(U)
MOTOR_L2: U$2.P$21(V)
MOTOR_L3: U$2.P$22(W)
MOTOR_PE: U$2.P$18(PE) ; also sheet 6
RELAY_BRAKE_SIGNAL: U$2.P$9
Unconnected: U$2.P$4 U$2.P$5 U$2.P$7(13B) U$2.P$8(13E) U$2.P$11

## Sheet 9 of 11: VFD - SEW Eurodrive
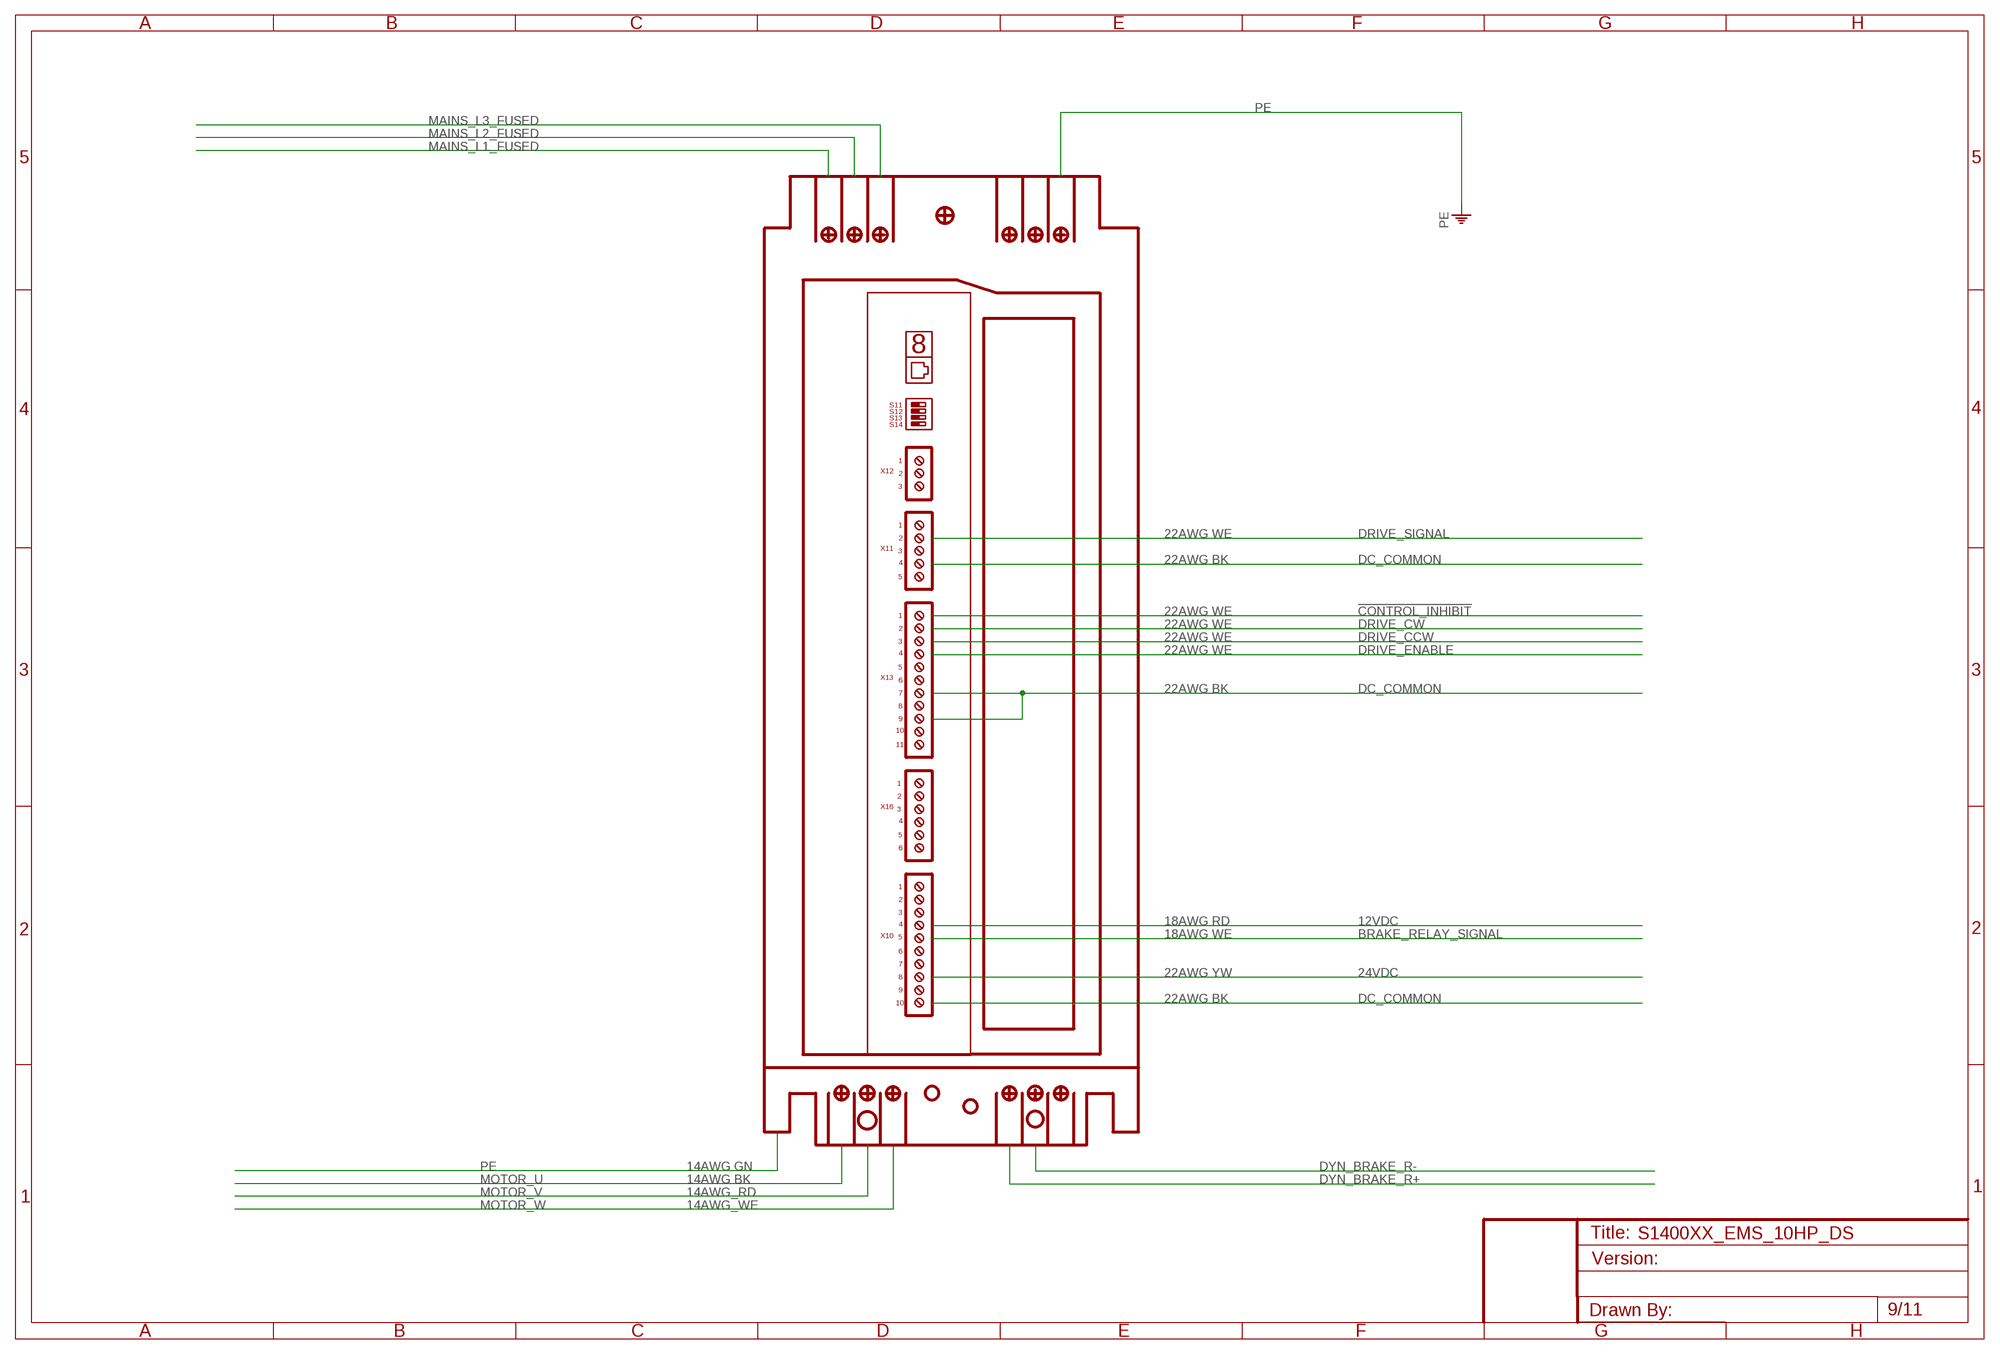
[diagram p8: schematic, sheet 9]

### Parts
U$15  SEW_MOVIDRIVE_MDX31B_0014  [BOGUS]

### Nets
12VDC: U$15.P$13 ; also sheet 3,4,5,7
24VDC: U$15.P$9 ; also sheet 8
!CONTROL_INHIBIT: U$15.P$33 ; also sheet 10
BRAKE_RELAY_SIGNAL: U$15.P$12
DC_COMMON: U$15.P$7 U$15.P$25 U$15.P$27 U$15.P$35 ; also sheet 3,4,5,6,7,8
DRIVE_CCW: U$15.P$31 ; also sheet 8,10
DRIVE_CW: U$15.P$32 ; also sheet 8,10
DRIVE_ENABLE: U$15.P$30 ; also sheet 10
DRIVE_SIGNAL: U$15.P$37 ; also sheet 3,5,6,10
DYN_BRAKE_R+: U$15.P$4
DYN_BRAKE_R-: U$15.P$5
MAINS_L1_FUSED: U$15.P$42 ; also sheet 4,6,8
MAINS_L2_FUSED: U$15.P$43 ; also sheet 4,6,8
MAINS_L3_FUSED: U$15.P$44 ; also sheet 4,6,8
MOTOR_U: U$15.P$1 ; also sheet 6
MOTOR_V: U$15.P$2 ; also sheet 6
MOTOR_W: U$15.P$3 ; also sheet 6
PE: U$15.P$47 ; also sheet 4,6
Unconnected: U$15.P$6 U$15.P$8 U$15.P$10 U$15.P$11 U$15.P$14 U$15.P$15 U$15.P$16 U$15.P$17 U$15.P$18 U$15.P$19 U$15.P$20 U$15.P$21 U$15.P$22 U$15.P$23 U$15.P$24 U$15.P$26 U$15.P$28 U$15.P$29 U$15.P$34 U$15.P$36 U$15.P$38 U$15.P$39 U$15.P$40 U$15.P$41 U$15.P$45 U$15.P$46

### Notes on the sheet
- 22AWG WE
- 22AWG BK
- 22AWG WE
- 22AWG WE
- 22AWG WE
- 22AWG WE
- 22AWG BK
- 18AWG RD
- 18AWG WE
- 22AWG YW
- 22AWG BK
- 14AWG GN
- 14AWG BK
- 14AWG_RD
- 14AWG_WE

## Sheet 10 of 11: Terminal Block Wiring
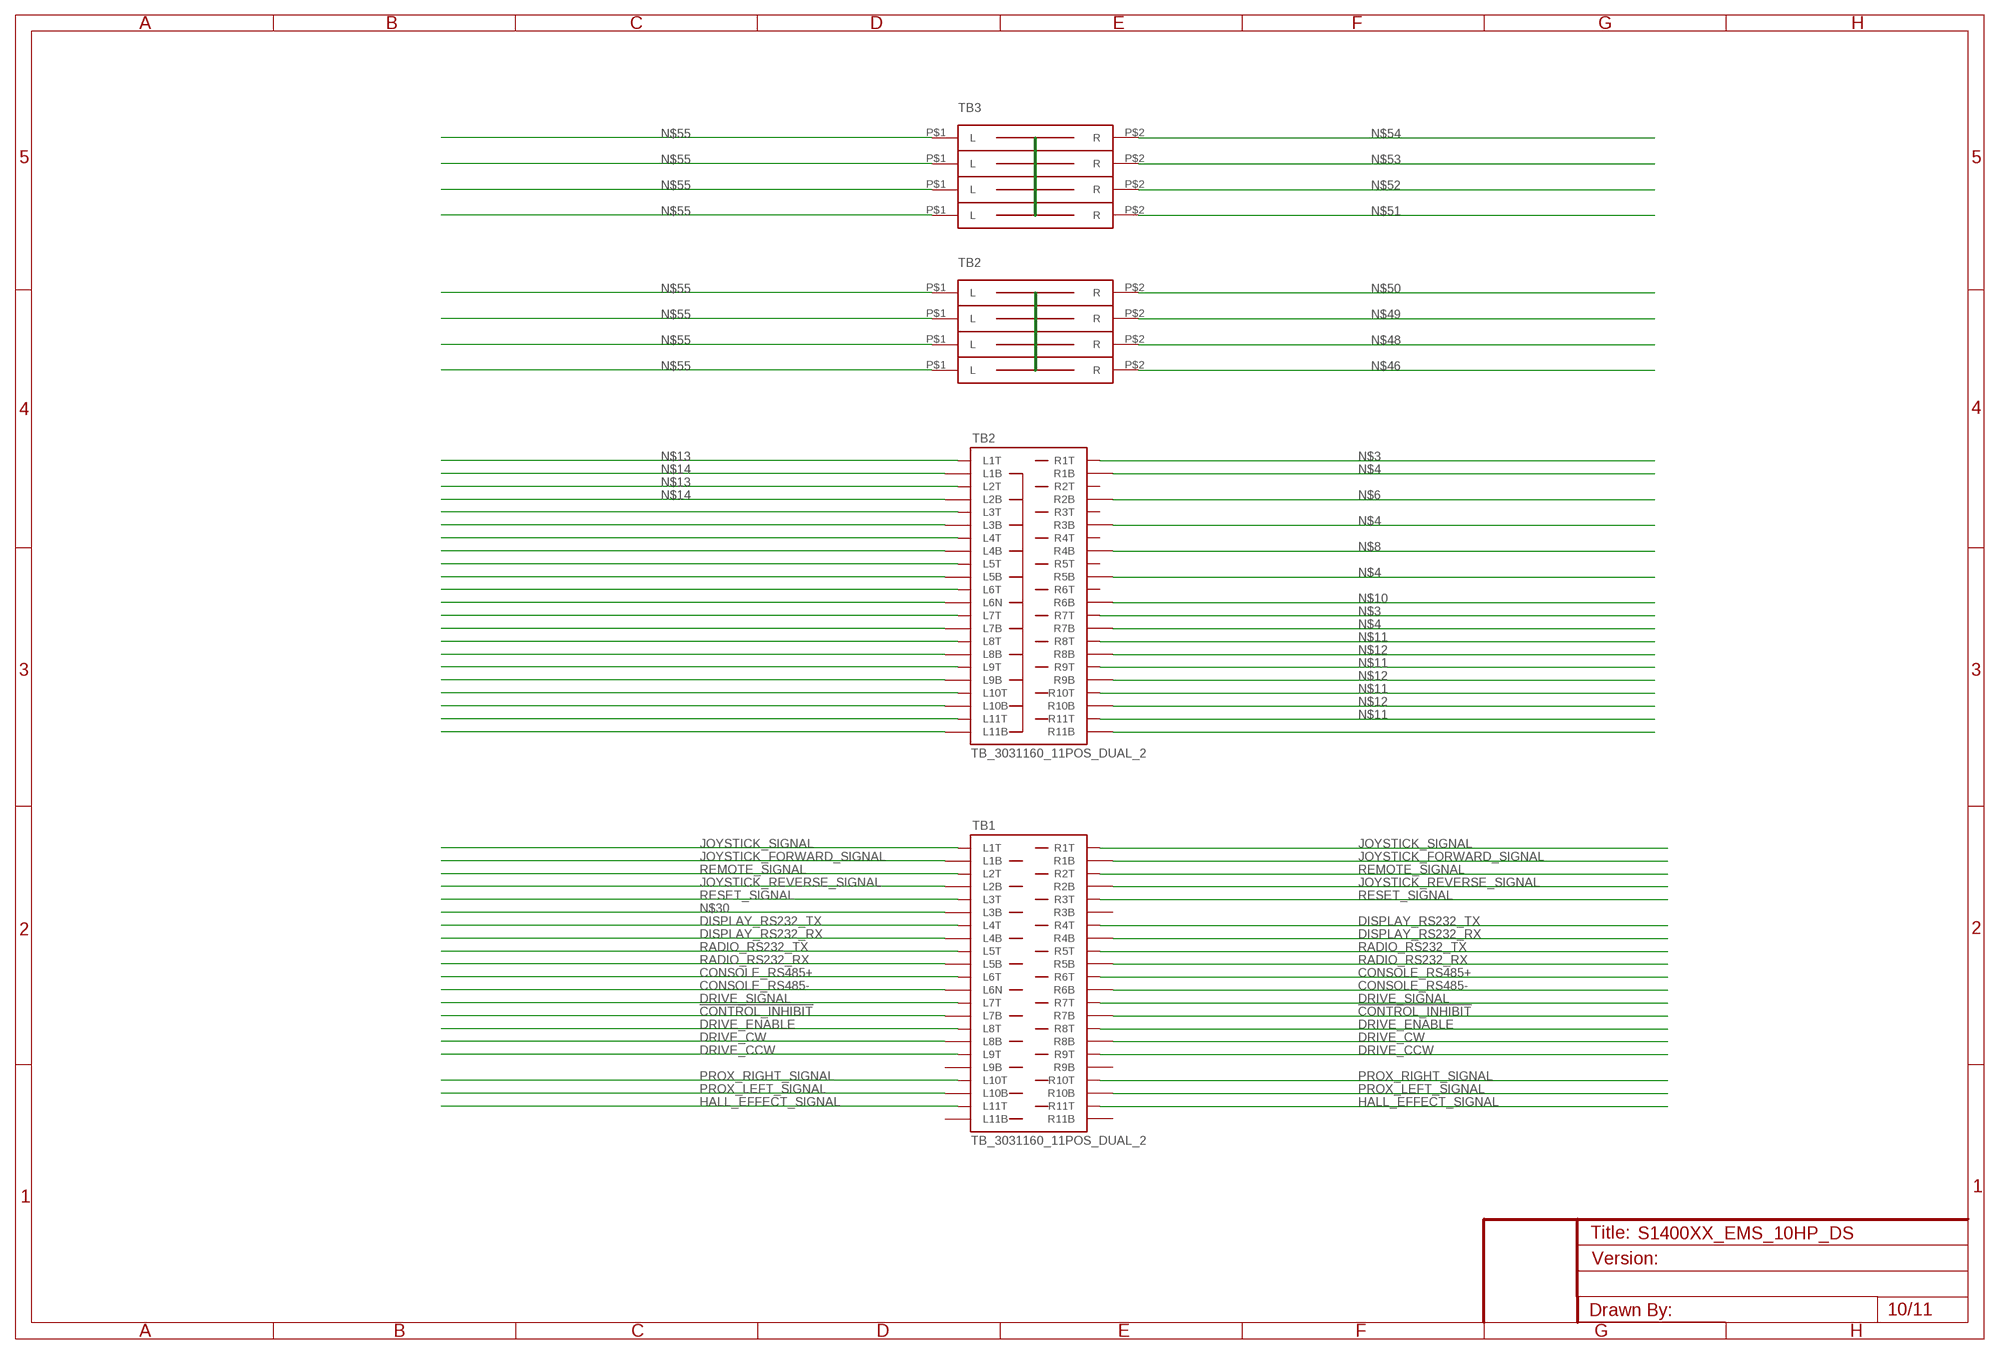
[diagram p9: schematic, sheet 10]

### Parts
TB1  TB_3031160_11POS_DUAL_2  [BOGUS]
TB2  TB_3031160_11POS_DUAL_2  [BOGUS]
U$5  TB_ENTERLEC_SINGLE  [BOGUS]
U$6  TB_ENTERLEC_SINGLE  [BOGUS]
U$7  TB_ENTERLEC_SINGLE  [BOGUS]
U$8  TB_ENTERLEC_SINGLE  [BOGUS]
U$9  TB_ENTERLEC_SINGLE  [BOGUS]
U$10  TB_ENTERLEC_SINGLE  [BOGUS]
U$11  TB_ENTERLEC_SINGLE  [BOGUS]
U$12  TB_ENTERLEC_SINGLE  [BOGUS]

### Nets
!CONTROL_INHIBIT: TB1.P$13(L7B) TB1.P$35(R7B) ; also sheet 9
CONSOLE_RS485+: TB1.P$12(L6T) TB1.P$34(R6T) ; also sheet 3,5
CONSOLE_RS485-: TB1.P$11(L6N) TB1.P$33(R6B) ; also sheet 3,5
DISPLAY_RS232_RX: TB1.P$7(L4B) TB1.P$29(R4B) ; also sheet 3,7
DISPLAY_RS232_TX: TB1.P$8(L4T) TB1.P$30(R4T) ; also sheet 5
DRIVE_CCW: TB1.P$18(L9T) TB1.P$40(R9T) ; also sheet 8,9
DRIVE_CW: TB1.P$15(L8B) TB1.P$37(R8B) ; also sheet 8,9
DRIVE_ENABLE: TB1.P$16(L8T) TB1.P$38(R8T) ; also sheet 9
DRIVE_SIGNAL: TB1.P$14(L7T) TB1.P$36(R7T) ; also sheet 3,5,6,9
HALL_EFFECT_SIGNAL: TB1.P$22(L11T) TB1.P$44(R11T) ; also sheet 3,5
JOYSTICK_FORWARD_SIGNAL: TB1.P$1(L1B) TB1.P$23(R1B) ; also sheet 3,5,7
JOYSTICK_REVERSE_SIGNAL: TB1.P$3(L2B) TB1.P$25(R2B) ; also sheet 3,5,7
JOYSTICK_SIGNAL: TB1.P$2(L1T) TB1.P$24(R1T) ; also sheet 3,5,7
N$3: TB2.P$24(R1T)
N$4: TB2.P$23(R1B)
N$13: TB2.P$2(L1T)
N$14: TB2.P$1(L1B)
N$30: TB1.P$5(L3B)
N$46: U$5.P$2(R)
N$48: U$6.P$2(R)
N$49: U$7.P$2(R)
N$50: U$8.P$2(R)
N$51: U$9.P$2(R)
N$52: U$10.P$2(R)
N$53: U$11.P$2(R)
N$54: U$12.P$2(R)
N$55: U$5.P$1(L) U$6.P$1(L) U$7.P$1(L) U$8.P$1(L) U$9.P$1(L) U$10.P$1(L) U$11.P$1(L) U$12.P$1(L)
PROX_LEFT_SIGNAL: TB1.P$19(L10B) TB1.P$41(R10B) ; also sheet 3,5
PROX_RIGHT_SIGNAL: TB1.P$20(L10T) TB1.P$42(R10T) ; also sheet 3,5
RADIO_RS232_RX: TB1.P$9(L5B) TB1.P$31(R5B) ; also sheet 3,5,7
RADIO_RS232_TX: TB1.P$10(L5T) TB1.P$32(R5T) ; also sheet 3,5,7
REMOTE_SIGNAL: TB1.P$4(L2T) TB1.P$26(R2T) ; also sheet 3,5,7
RESET_SIGNAL: TB1.P$6(L3T) TB1.P$28(R3T) ; also sheet 3,5,7
Unconnected: TB1.P$17(L9B) TB1.P$21(L11B) TB1.P$27(R3B) TB1.P$39(R9B) TB1.P$43(R11B) TB2.P$3(L2B) TB2.P$4(L2T) TB2.P$5(L3B) TB2.P$6(L3T) TB2.P$7(L4B) TB2.P$8(L4T) TB2.P$9(L5B) TB2.P$10(L5T) TB2.P$11(L6N) TB2.P$12(L6T) TB2.P$13(L7B) TB2.P$14(L7T) TB2.P$15(L8B) TB2.P$16(L8T) TB2.P$17(L9B) TB2.P$18(L9T) TB2.P$19(L10B) TB2.P$20(L10T) TB2.P$21(L11B) TB2.P$22(L11T) TB2.P$25(R2B) TB2.P$26(R2T) TB2.P$27(R3B) TB2.P$28(R3T) TB2.P$29(R4B) TB2.P$30(R4T) TB2.P$31(R5B) TB2.P$32(R5T) TB2.P$33(R6B) TB2.P$34(R6T) TB2.P$35(R7B) TB2.P$36(R7T) TB2.P$37(R8B) TB2.P$38(R8T) TB2.P$39(R9B) TB2.P$40(R9T) TB2.P$41(R10B) TB2.P$42(R10T) TB2.P$43(R11B) TB2.P$44(R11T)

### Notes on the sheet
- TB3
- TB2

## Sheet 11 of 11
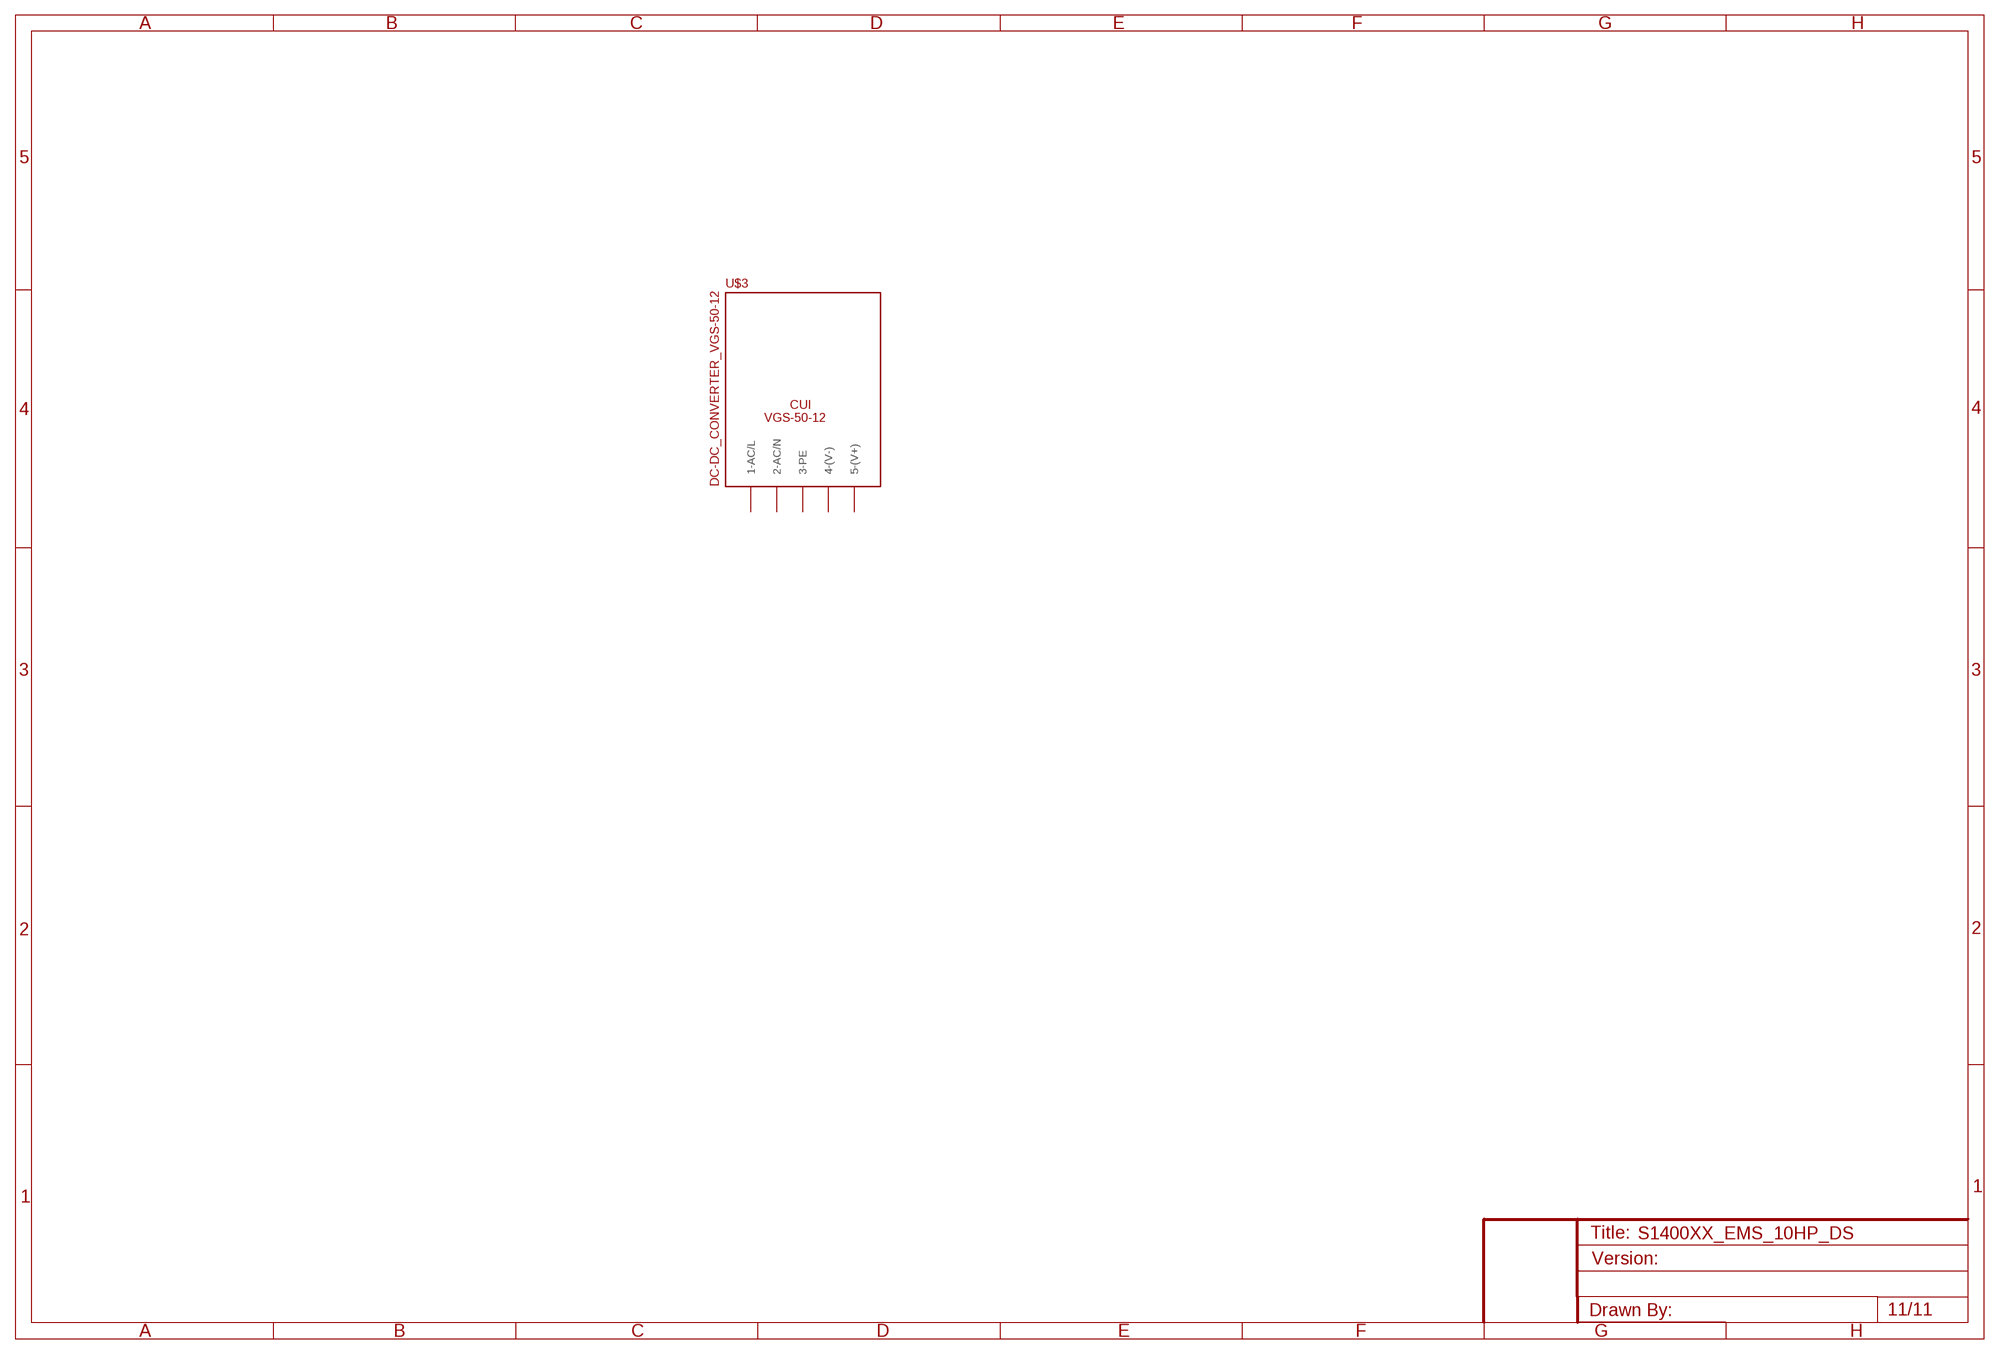
[diagram p10: schematic, sheet 11]

### Parts
U$3  DC-DC_CONVERTER_VGS-50-12  [BOGUS]
Unconnected: U$3.P$1(1-AC/L) U$3.P$2(2-AC/N) U$3.P$3(3-PE) U$3.P$4(4-(V-)) U$3.P$5(5-(V+))

## Power pins joined to a net without a drawn wire
PE: U$2.P$17(PE) U$2.P$19(PE)

## Library data of the parts
TB1 TB2 = SOSI-TerminalBlocks:TB_3031160_11POS_DUAL_2
U$1 = DougM.SOSI.Microcontroller:RABBIT_BL4S200(RCM4310): 9210-0442 COMPUTER SINGLE-BOARD BL4S200 Rabbit Semiconductor 20-101-1220 Digi-Key 316-1164-ND
U$2 = DougM-SOSI-Wiring-Diagram.rpt:LEESON_INVERTER_3PHASE
U$3 = DougM-SOSI-Wiring-Diagram.rpt:DC-DC_CONVERTER_VGS-50-12
U$4 U$16-U$35 = SOSI-TerminalBlocks:TB_3031160_1POS
U$5-U$12 = SOSI-TerminalBlocks:TB_ENTERLEC_SINGLE
U$13 = SOSI:DCDCCONVERTER_240AC_12VDC
U$14 = SOSI:DCDCCONVERTER_240AC_5VDC
U$15 = SOSI-Wiring-Diagram.rpt:SEW_MOVIDRIVE_MDX31B_0014
U$36 = DougM-SOSI-Wiring-Diagram.rpt:JOYSTICK_PRO-5: 9280-0000 PRO5-202.1085 (w/20k center tap potentiometer) Joystick (Master Switch), w/20k center tap potentiometer J. R. Merritt Controls
U$37 = DougM-SOSI-Wiring-Diagram.rpt:INDICATOR_LIGHT: 9210-0341 OMPBD7D-P3N3 Indicator Light, LED, Complete Asssembly, 22.5mm, IP66, 24V AC/DC Omega www.omega.com
U$38 U$39 = DougM-SOSI-Wiring-Diagram.rpt:SWITCH_DPDT: 9210-0123 Switch, Non-Illuminated, 30.5mm, Type 4/4x/13, 2 Pos. Selector, Std. Knob Maint, 1 N.O.-1 N.C., WHITE 9210-0175?? Switch, Selector, 2-Position, Maintained, Blk handle w/ wht insert (old #800H-24HRAH2KB6AX)
U$40 = DougM-SOSI-Wiring-Diagram.rpt:SWITCH_MOM_NO: 9210-0072 Mouser Part #: 850-59-313 Manufacturer Part #: 59-313
U$41 = DougM-SOSI-Wiring-Diagram.rpt:SPARKFUN_XBEE_EXPLORER_SERIAL
U$42 = DougM-SOSI-Wiring-Diagram.rpt:SEETRON_GLO-416
VFD = Inverters:HITACHI_WJ200-075LF